# Altium project CPC-UNIFEI.PrjPcb (part 3 of 4)

## Sheet DIGITAL_INPUTS.SchDoc
size A3; SheetNumber: 7; SheetTotal: 14
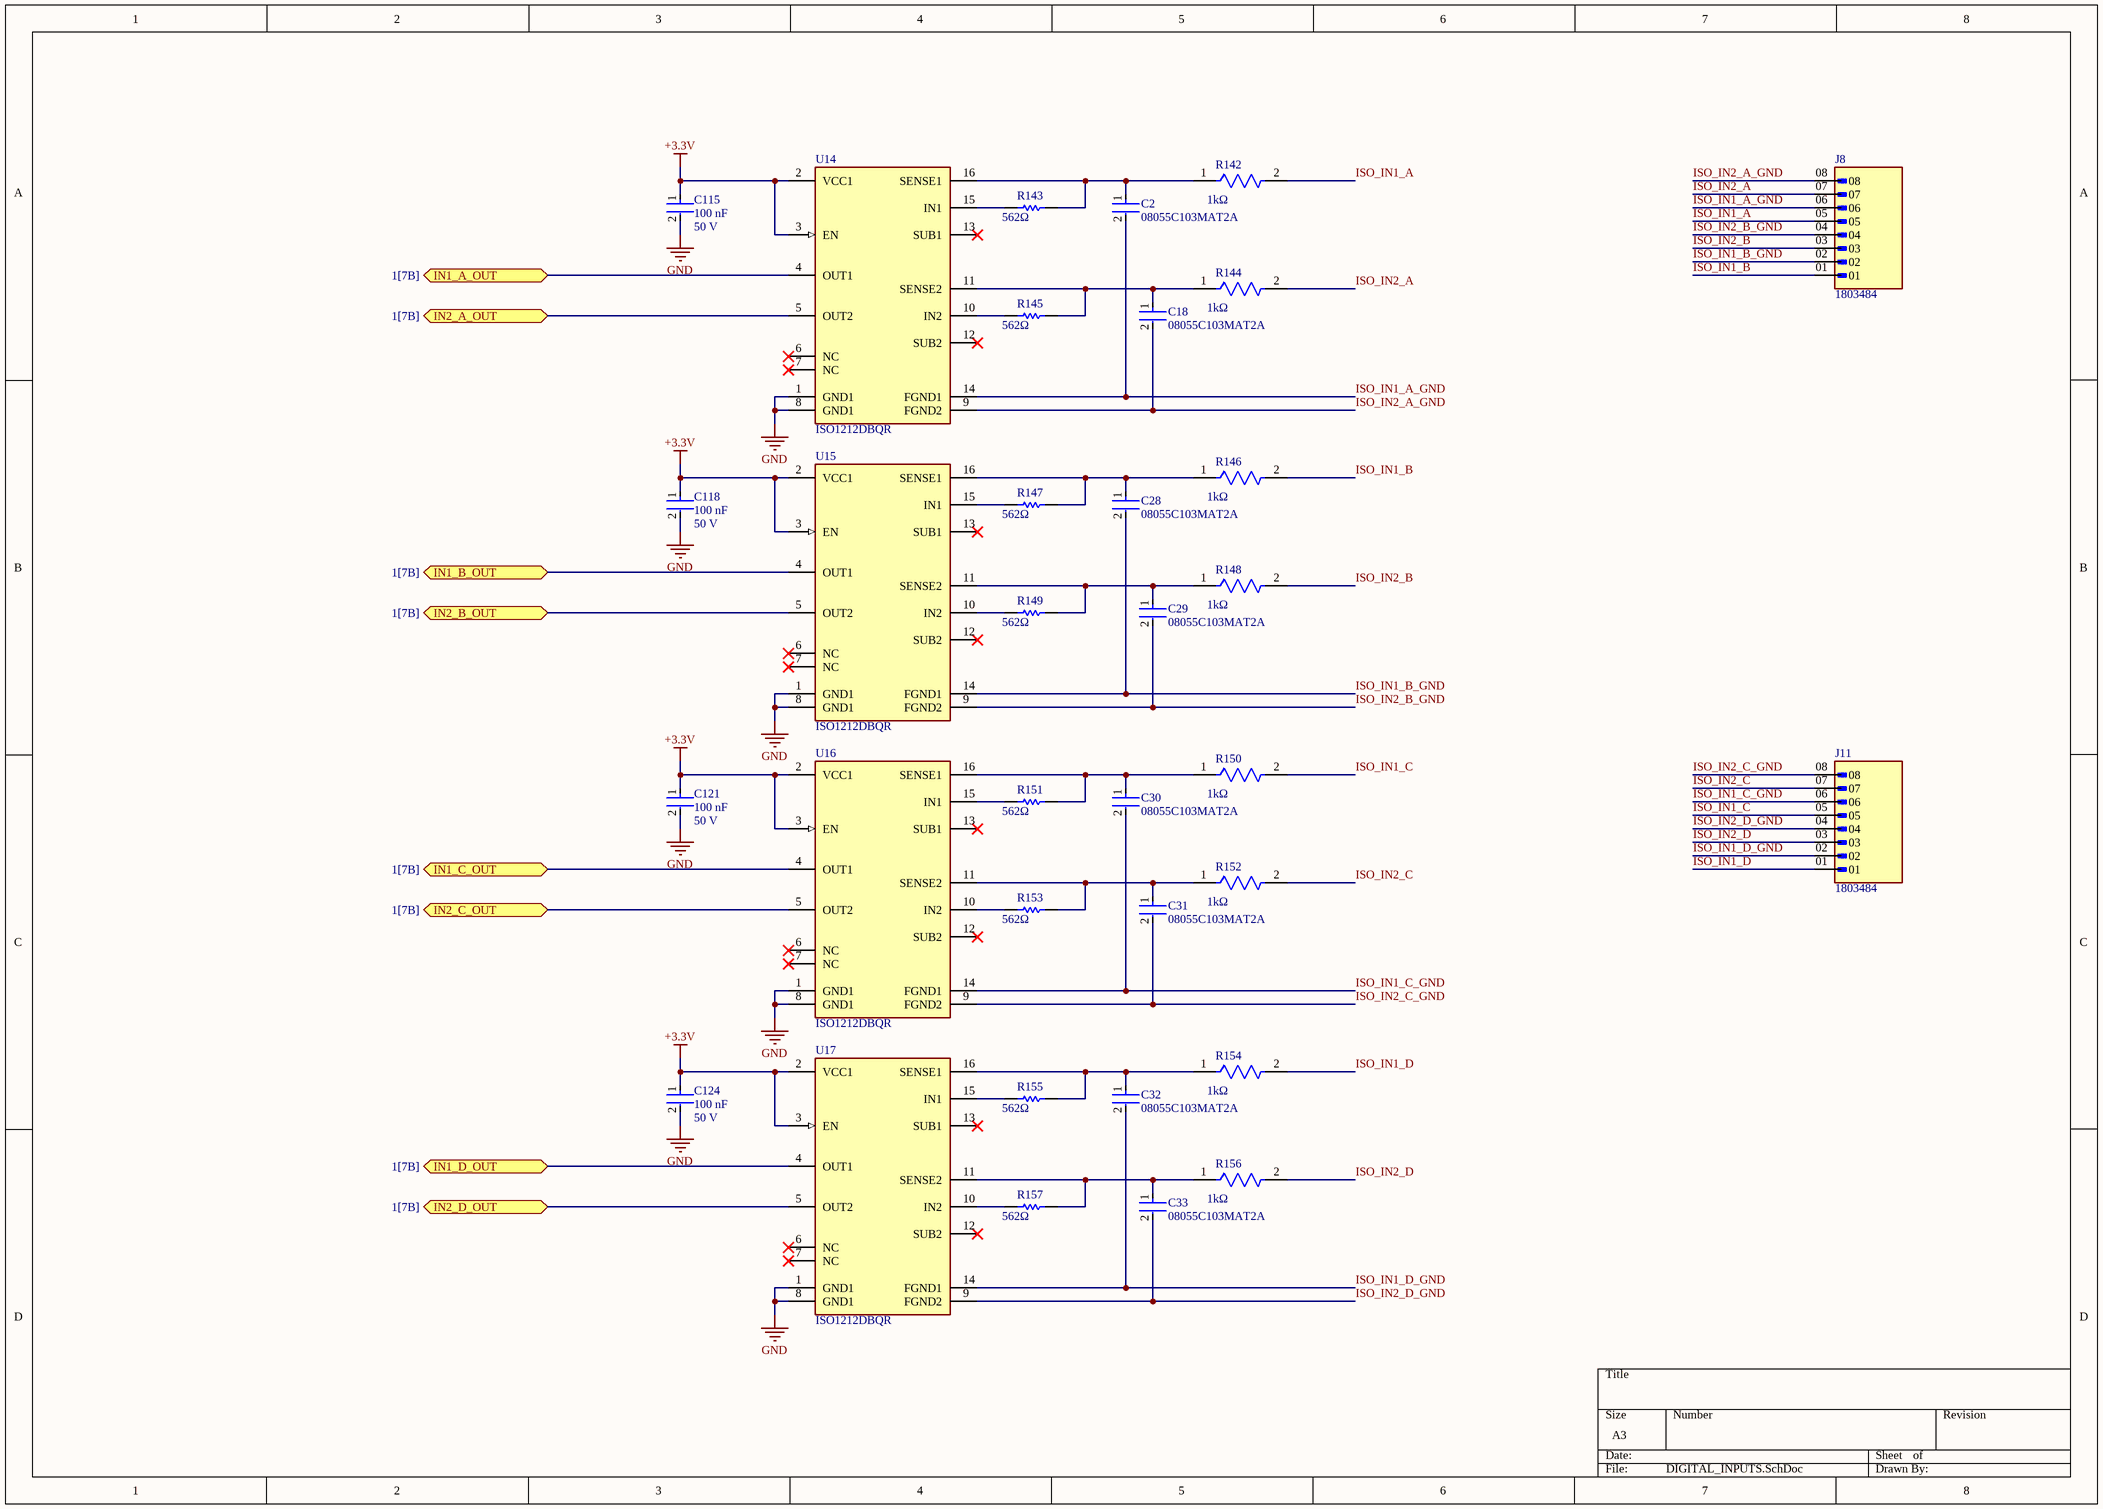
[diagram p6: DIGITAL_INPUTS.SchDoc]

### Parts
C2  08055C103MAT2A  [FP-0805-L_2_01_0_2-W_1_25-MFG]
C18  08055C103MAT2A  [FP-0805-L_2_01_0_2-W_1_25-MFG]
C28  08055C103MAT2A  [FP-0805-L_2_01_0_2-W_1_25-MFG]
C29  08055C103MAT2A  [FP-0805-L_2_01_0_2-W_1_25-MFG]
C30  08055C103MAT2A  [FP-0805-L_2_01_0_2-W_1_25-MFG]
C31  08055C103MAT2A  [FP-0805-L_2_01_0_2-W_1_25-MFG]
C32  08055C103MAT2A  [FP-0805-L_2_01_0_2-W_1_25-MFG]
C33  08055C103MAT2A  [FP-0805-L_2_01_0_2-W_1_25-MFG]
C115  value 100 nF  Voltage Rating: 50 V  [FP-C0603C-CF-IPC_B]  (hidden comment: C0603C104M5RACTU)
C118  value 100 nF  Voltage Rating: 50 V  [FP-C0603C-CF-IPC_B]  (hidden comment: C0603C104M5RACTU)
C121  value 100 nF  Voltage Rating: 50 V  [FP-C0603C-CF-IPC_B]  (hidden comment: C0603C104M5RACTU)
C124  value 100 nF  Voltage Rating: 50 V  [FP-C0603C-CF-IPC_B]  (hidden comment: C0603C104M5RACTU)
J8  1803484  [PHOENIX_1803484]
J11  1803484  [PHOENIX_1803484]
R142  Resistance: 1kΩ  [FP-AC0603-IPC_B]  (hidden comment: AC0603FR-071KL)
R143  Resistance: 562Ω  [RESC1608X55X25ML10T15]  (hidden comment: RC0603FR-07562RL)
R144  Resistance: 1kΩ  [FP-AC0603-IPC_B]  (hidden comment: AC0603FR-071KL)
R145  Resistance: 562Ω  [RESC1608X55X25ML10T15]  (hidden comment: RC0603FR-07562RL)
R146  Resistance: 1kΩ  [FP-AC0603-IPC_B]  (hidden comment: AC0603FR-071KL)
R147  Resistance: 562Ω  [RESC1608X55X25ML10T15]  (hidden comment: RC0603FR-07562RL)
R148  Resistance: 1kΩ  [FP-AC0603-IPC_B]  (hidden comment: AC0603FR-071KL)
R149  Resistance: 562Ω  [RESC1608X55X25ML10T15]  (hidden comment: RC0603FR-07562RL)
R150  Resistance: 1kΩ  [FP-AC0603-IPC_B]  (hidden comment: AC0603FR-071KL)
R151  Resistance: 562Ω  [RESC1608X55X25ML10T15]  (hidden comment: RC0603FR-07562RL)
R152  Resistance: 1kΩ  [FP-AC0603-IPC_B]  (hidden comment: AC0603FR-071KL)
R153  Resistance: 562Ω  [RESC1608X55X25ML10T15]  (hidden comment: RC0603FR-07562RL)
R154  Resistance: 1kΩ  [FP-AC0603-IPC_B]  (hidden comment: AC0603FR-071KL)
R155  Resistance: 562Ω  [RESC1608X55X25ML10T15]  (hidden comment: RC0603FR-07562RL)
R156  Resistance: 1kΩ  [FP-AC0603-IPC_B]  (hidden comment: AC0603FR-071KL)
R157  Resistance: 562Ω  [RESC1608X55X25ML10T15]  (hidden comment: RC0603FR-07562RL)
U14  ISO1212DBQR  [FP-DBQ0016A-MFG]
U15  ISO1212DBQR  [FP-DBQ0016A-MFG]
U16  ISO1212DBQR  [FP-DBQ0016A-MFG]
U17  ISO1212DBQR  [FP-DBQ0016A-MFG]

### Ports
IN1_A_OUT (bidir, see 1[7B]), IN1_B_OUT (bidir, see 1[7B]), IN1_C_OUT (bidir, see 1[7B]), IN1_D_OUT (bidir, see 1[7B]), IN2_A_OUT (bidir, see 1[7B]), IN2_B_OUT (bidir, see 1[7B]), IN2_C_OUT (bidir, see 1[7B]), IN2_D_OUT (bidir, see 1[7B])

### Nets
+3.3V: C115.1 C118.1 C121.1 C124.1 U14.2(VCC1) U14.3(EN) U15.2(VCC1) U15.3(EN) U16.2(VCC1) U16.3(EN) U17.2(VCC1) U17.3(EN)
GND: C115.2 C118.2 C121.2 C124.2 U14.1(GND1) U14.8(GND1) U15.1(GND1) U15.8(GND1) U16.1(GND1) U16.8(GND1) U17.1(GND1) U17.8(GND1)
ISO_IN1_A: J8.05 R142.2
ISO_IN1_A_GND: C2.2 J8.06 U14.14(FGND1)
ISO_IN1_B: J8.01 R146.2
ISO_IN1_B_GND: C28.2 J8.02 U15.14(FGND1)
ISO_IN1_C: J11.05 R150.2
ISO_IN1_C_GND: C30.2 J11.06 U16.14(FGND1)
ISO_IN1_D: J11.01 R154.2
ISO_IN1_D_GND: C32.2 J11.02 U17.14(FGND1)
ISO_IN2_A: J8.07 R144.2
ISO_IN2_A_GND: C18.2 J8.08 U14.9(FGND2)
ISO_IN2_B: J8.03 R148.2
ISO_IN2_B_GND: C29.2 J8.04 U15.9(FGND2)
ISO_IN2_C: J11.07 R152.2
ISO_IN2_C_GND: C31.2 J11.08 U16.9(FGND2)
ISO_IN2_D: J11.03 R156.2
ISO_IN2_D_GND: C33.2 J11.04 U17.9(FGND2)
PE7: U16.5(OUT2) ; port IN2_C_OUT
PE8: U17.4(OUT1) ; port IN1_D_OUT
PE9: U17.5(OUT2) ; port IN2_D_OUT
PF13: U14.4(OUT1) ; port IN1_A_OUT
PF14: U14.5(OUT2) ; port IN2_A_OUT
PF15: U15.4(OUT1) ; port IN1_B_OUT
PG0: U15.5(OUT2) ; port IN2_B_OUT
PG1: U16.4(OUT1) ; port IN1_C_OUT
NetC2_1: C2.1 R142.1 R143.2 U14.16(SENSE1)
NetC18_1: C18.1 R144.1 R145.2 U14.11(SENSE2)
NetC28_1: C28.1 R146.1 R147.2 U15.16(SENSE1)
NetC29_1: C29.1 R148.1 R149.2 U15.11(SENSE2)
NetC30_1: C30.1 R150.1 R151.2 U16.16(SENSE1)
NetC31_1: C31.1 R152.1 R153.2 U16.11(SENSE2)
NetC32_1: C32.1 R154.1 R155.2 U17.16(SENSE1)
NetC33_1: C33.1 R156.1 R157.2 U17.11(SENSE2)
NetR143_1: R143.1 U14.15(IN1)
NetR145_1: R145.1 U14.10(IN2)
NetR147_1: R147.1 U15.15(IN1)
NetR149_1: R149.1 U15.10(IN2)
NetR151_1: R151.1 U16.15(IN1)
NetR153_1: R153.1 U16.10(IN2)
NetR155_1: R155.1 U17.15(IN1)
NetR157_1: R157.1 U17.10(IN2)

Not connected (* = marked no-connect by the designer): U14 6(NC)* 7(NC)* 12(SUB2)* 13(SUB1)*; U15 6(NC)* 7(NC)* 12(SUB2)* 13(SUB1)*; U16 6(NC)* 7(NC)* 12(SUB2)* 13(SUB1)*; U17 6(NC)* 7(NC)* 12(SUB2)* 13(SUB1)*

### Library data of the parts
C2 C18 C28-C33 = CMP-2007-04366-2: General Purpose Ceramic Capacitor, 0805, 10nF, 20%, X7R, 0.15, 50V; Insulation Resistance: 100GR; Dissipation Factor: 2.5%; Mount: Surface Mount; Packaging: Tape and Reel; Max Operating Temperature: 125°C; Series: -; Voltage Rating: 50V; Contact Plating: Tin; Case Code (Metric): 2012; Depth: 1.25mm; Case/Package: 0805; Min Operating Temperature: -55°C; Termination: SMD/SMT; RoHS Compliant: Yes; Height: 0.94mm; Construction: Flat; Voltage: 50V; REACH SVHC: No SVHC; Dielectric: X7R; Voltage Rating (DC): 50V; Case Code (Imperial): 0805; Capacitance: 10nF; Lead Free: Lead Free; Thickness: 0.037inch; Package Quantity: 1; Radiation Hardening: No; Number of Pins: 2; Width: 0.049inch; Dielectric Material: Ceramic; Tolerance: 20%; Length: 2.01mm
C115 C118 C121 C124 = CMP-2006-03068-2: CAP CER 0.1UF 50V 20% X7R 0603; Manufacturer: KEMET; Material: Ceramic; Tolerance: 0.2; Temperature Coefficient: 30ppm/°C; Automotive Grade: Grade 1; Capacitance: 0.10 μF; Temperature Range High: +125°C; Device Class L3: Ceramic Capacitors; Manufacturer Part Number: C0603C104M5RACTU; Height: 0.87mm; Category: Cap; RoHS: TRUE; Digikey Description: CAP CER 0.1UF 50V 20% X7R 0603; ComponentLink2URL: https://api.kemet.com/component-edge/download/datasheet/C0603C100J5GACAUTO.pdf; Lead Free: Yes; Temperature Range Low: -55°C; Device Class L1: Passive Components; ComponentLink2Description: Datasheet; Temperature Characteristic: X7R; Automotive: Yes; Temperature: -55°C to +125°C; Octopart: https://octopart.com/c0603c104m5ractu-kemet-11855687; Device Class L2: Capacitors; Package: C0603C-CF; Mouser Description: Multilayer Ceramic Capacitors MLCC - SMD/SMT 50volts 0.1uF X7R 20%
J8 J11 = 1803484: MF: {'manufacturer': u'Phoenix Contact'}; Package: None; Price: None; Value: *; MP: 1803484; Availability: Unavailable
R142 R144 R146 R148 R150 R152 R154 R156 = CMP-2000-04828-3: RES 1kΩ 1.00% 0.1W 0603; Voltage Rating: 50V; Power Rating: 100mW; Tolerance: 1%; Temperature Coefficient: 100ppm/°C; Depth: 0.8mm; Case/Package: 0603; Size Code: 0603; Case Code (Metric): 1608; Height: 0.022inch; Series: AC; Width: 0.031inch; Construction: Rectangular; Length: 0.063inch; Case Code (Imperial): 0603; Package Quantity: 1; RoHS Compliant: Yes; Features: Moisture Resistant; Resistor Type: Thick Film; Max Power Dissipation: 100mW; Packaging: Tape and Reel; Termination: SMD/SMT; Ratings: AEC-Q200; Max Operating Temperature: 155°C; Min Operating Temperature: -55°C; Military Standard: Not; Lead Free: Lead Free; Number of Terminations: 2
R143 R145 R147 R149 R151 R153 R155 R157 = CMP-2000-04085-1: Manufacturer: Yageo; Part Number: RC0603FR-07562RL
U14-U17 = CMP-04872-000004-1: ISOLATED 24-V TO 60-V DIGITAL IN; Manufacturer: Texas Instruments; Standoff Height: 0.11mm; Max Supply Voltage: 5.5V; Min Supply Voltage: 2.25V; Nominal Supply Current: 194-389mA; Max Junction Temp: +150°C; ComponentLink2URL: http://www.ti.com/lit/ds/symlink/iso1212.pdf; Device Class L1: Integrated Circuits (ICs); Octopart: https://octopart.com/iso1212dbqr-texas+instruments-84619664; Ipc Land Pattern Name: SOP64P600X175-16; Ambient Temperature Range High: +125°C; Automotive: No; Temperature Range High: +125°C; Manufacturer Part Number: ISO1212DBQR; Package: DBQ0016A; Lead Free: Yes; RoHS: TRUE; Device Class L3: unset; Digikey Description: ISOLATED 24-V TO 60-V DIGITAL IN; ComponentLink2Description: Datasheet; Height: 1.75mm; Device Class L2: Interface ICs; Temperature Range Low: -55°C; Ambient Temperature Range Low: -40°C; Category: IC; Temperature: -55°C to +125°C

## Sheet DIGITAL_OUTPUTS_BLOCK_A.SchDoc
size A3; SheetNumber: 8; SheetTotal: 14
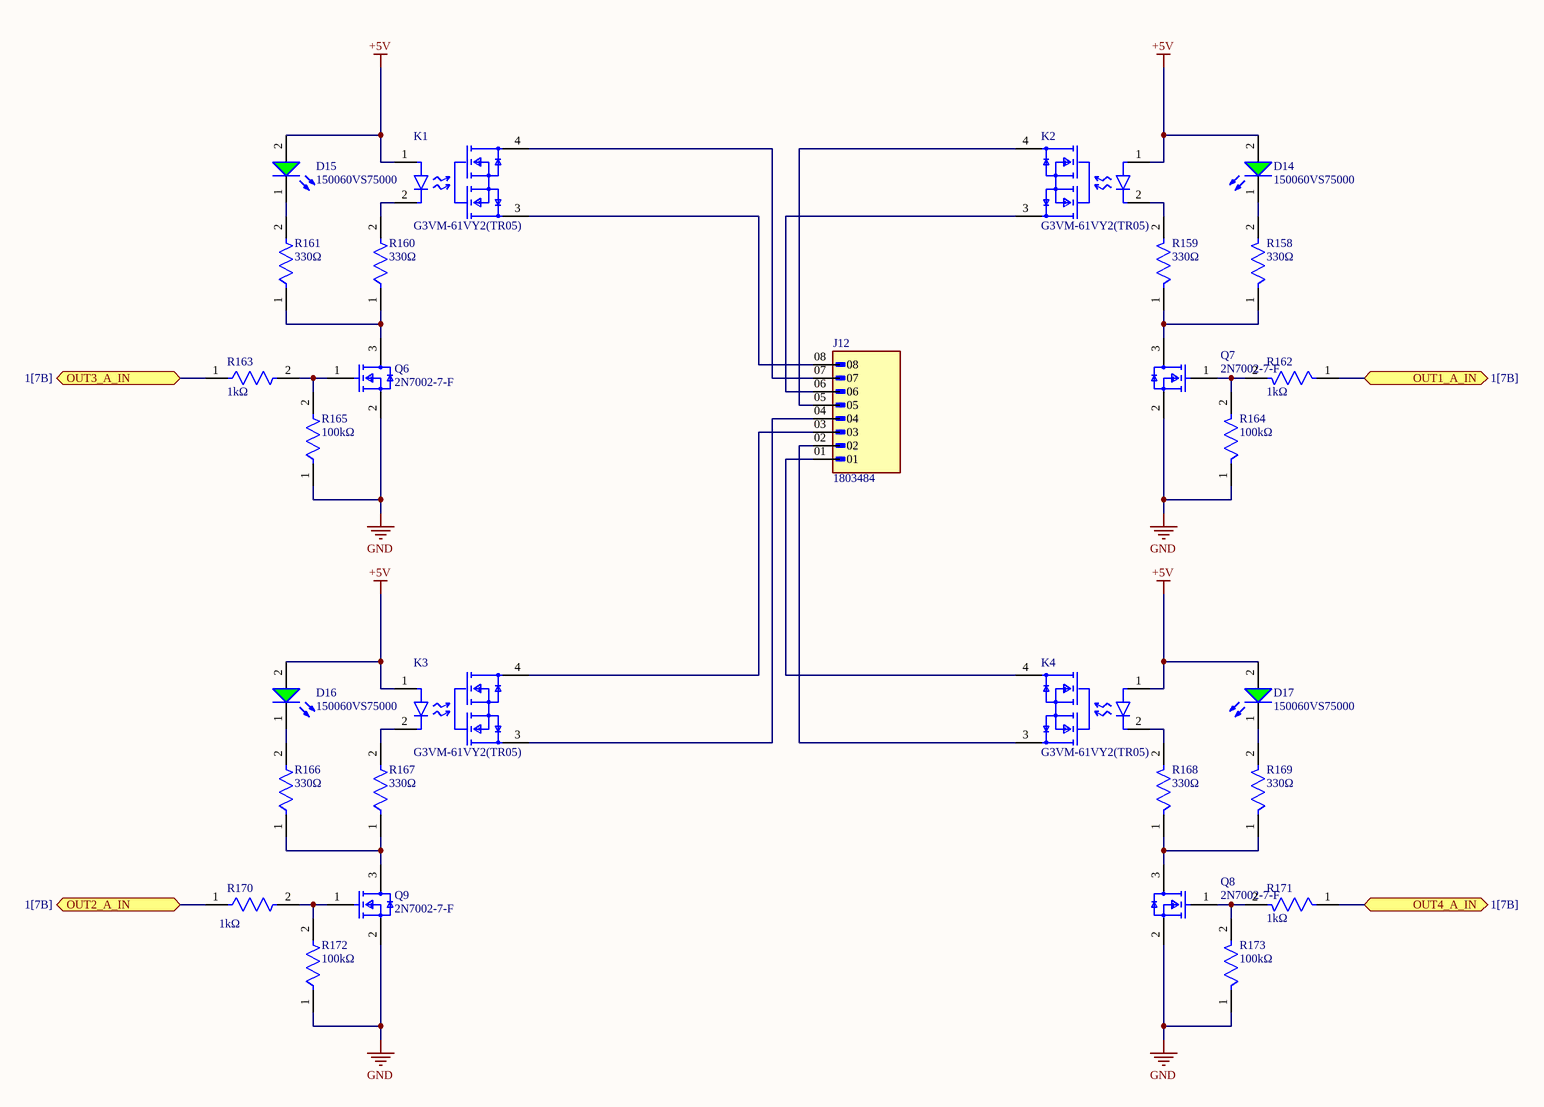
[diagram p7: DIGITAL_OUTPUTS_BLOCK_A.SchDoc]

### Parts
D14  150060VS75000  [WL-SMCW_0603_150060xx75000]
D15  150060VS75000  [WL-SMCW_0603_150060xx75000]
D16  150060VS75000  [WL-SMCW_0603_150060xx75000]
D17  150060VS75000  [WL-SMCW_0603_150060xx75000]
J12  1803484  [PHOENIX_1803484]
K1  G3VM-61VY2(TR05)  [FP-G3VM-61VY2_TR05-MFG]
K2  G3VM-61VY2(TR05)  [FP-G3VM-61VY2_TR05-MFG]
K3  G3VM-61VY2(TR05)  [FP-G3VM-61VY2_TR05-MFG]
K4  G3VM-61VY2(TR05)  [FP-G3VM-61VY2_TR05-MFG]
Q6  2N7002-7-F  [FP-SOT23-IPC_A]
Q7  2N7002-7-F  [FP-SOT23-IPC_A]
Q8  2N7002-7-F  [FP-SOT23-IPC_A]
Q9  2N7002-7-F  [FP-SOT23-IPC_A]
R158  Resistance: 330Ω  [FP-CRCW0603-e3-MFG]  (hidden comment: CRCW0603330RFKEA)
R159  Resistance: 330Ω  [FP-CRCW0603-e3-MFG]  (hidden comment: CRCW0603330RFKEA)
R160  Resistance: 330Ω  [FP-CRCW0603-e3-MFG]  (hidden comment: CRCW0603330RFKEA)
R161  Resistance: 330Ω  [FP-CRCW0603-e3-MFG]  (hidden comment: CRCW0603330RFKEA)
R162  Resistance: 1kΩ  [FP-AC0603-IPC_B]  (hidden comment: AC0603FR-071KL)
R163  Resistance: 1kΩ  [FP-AC0603-IPC_B]  (hidden comment: AC0603FR-071KL)
R164  Resistance: 100kΩ  [FP-CRCW0603-e3-IPC_B]  (hidden comment: CRCW0603100KFKEC)
R165  Resistance: 100kΩ  [FP-CRCW0603-e3-IPC_B]  (hidden comment: CRCW0603100KFKEC)
R166  Resistance: 330Ω  [FP-CRCW0603-e3-MFG]  (hidden comment: CRCW0603330RFKEA)
R167  Resistance: 330Ω  [FP-CRCW0603-e3-MFG]  (hidden comment: CRCW0603330RFKEA)
R168  Resistance: 330Ω  [FP-CRCW0603-e3-MFG]  (hidden comment: CRCW0603330RFKEA)
R169  Resistance: 330Ω  [FP-CRCW0603-e3-MFG]  (hidden comment: CRCW0603330RFKEA)
R170  Resistance: 1kΩ  [FP-AC0603-IPC_B]  (hidden comment: AC0603FR-071KL)
R171  Resistance: 1kΩ  [FP-AC0603-IPC_B]  (hidden comment: AC0603FR-071KL)
R172  Resistance: 100kΩ  [FP-CRCW0603-e3-IPC_B]  (hidden comment: CRCW0603100KFKEC)
R173  Resistance: 100kΩ  [FP-CRCW0603-e3-IPC_B]  (hidden comment: CRCW0603100KFKEC)

### Ports
OUT1_A_IN (bidir, see 1[7B]), OUT2_A_IN (bidir, see 1[7B]), OUT3_A_IN (bidir, see 1[7B]), OUT4_A_IN (bidir, see 1[7B])

### Nets
+5V: D14.2(A) D15.2(A) D16.2(A) D17.2(A) K1.1(A) K2.1(A) K3.1(A) K4.1(A)
GND: Q6.2(S) Q7.2(S) Q8.2(S) Q9.2(S) R164.1 R165.1 R172.1 R173.1
PD0: R162.1 ; port OUT1_A_IN
PD1: R171.1 ; port OUT4_A_IN
PD3: R163.1 ; port OUT3_A_IN
PD4: R170.1 ; port OUT2_A_IN
NetD14_1: D14.1(K) R158.2
NetD15_1: D15.1(K) R161.2
NetD16_1: D16.1(K) R166.2
NetD17_1: D17.1(K) R169.2
NetJ12_01: J12.01 K4.4(2_DRAIN)
NetJ12_02: J12.02 K4.3(1_DRAIN)
NetJ12_03: J12.03 K3.4(2_DRAIN)
NetJ12_04: J12.04 K3.3(1_DRAIN)
NetJ12_05: J12.05 K2.4(2_DRAIN)
NetJ12_06: J12.06 K2.3(1_DRAIN)
NetJ12_07: J12.07 K1.4(2_DRAIN)
NetJ12_08: J12.08 K1.3(1_DRAIN)
NetK1_2: K1.2(C) R160.2
NetK2_2: K2.2(C) R159.2
NetK3_2: K3.2(C) R167.2
NetK4_2: K4.2(C) R168.2
NetQ6_1: Q6.1(G) R163.2 R165.2
NetQ6_3: Q6.3(D) R160.1 R161.1
NetQ7_1: Q7.1(G) R162.2 R164.2
NetQ7_3: Q7.3(D) R158.1 R159.1
NetQ8_1: Q8.1(G) R171.2 R173.2
NetQ8_3: Q8.3(D) R168.1 R169.1
NetQ9_1: Q9.1(G) R170.2 R172.2
NetQ9_3: Q9.3(D) R166.1 R167.1

### Library data of the parts
D14-D17 = CMP-1426-00006-6: NexarPartId: 29717778; Reverse Voltage: 5V; Forward Voltage: 2V; Viewing Angle: 140°; Luminous Intensity: 40mcd; Test Current: 20mA; Max Junction Temperature (Tj): 95°C; Wavelength: 570nm; Forward Current: 100mA; Color: Green; Lens Style: Clear, Rectangular; Power Dissipation: 72mW; Peak Wavelength: 572nm; Packaging: Tape and Reel; REACH SVHC: Unknown; Width: 800µm; Max Operating Temperature: 85°C; Number of Pins: 2; RoHS: Compliant; Dominant Wavelength: 570nm; Min Operating Temperature: -40°C; Case Code (Imperial): 0603; Height: 700µm; Length: 1.6mm; Case Code (Metric): 1608; Case/Package: 0603; Max Reverse Voltage (DC): 5V; Mount: Surface Mount
J12 = 1803484: MF: {'manufacturer': u'Phoenix Contact'}; Package: None; Price: None; Value: *; MP: 1803484; Availability: Unavailable
K1-K4 = CMP-08825-000057-1: SSR RELAY SPST-NO 500MA 0-60V; Throw Configuration: SPST; On-State Resistance: 2R; Load Current: 500mA; RoHS Compliant: Yes; Relay Type: Relay; Case/Package: SOP; Mount: Surface Mount; Termination: Gull Wing; Number of Pins: 4; Packaging: Tape and Reel
Q6-Q9 = CMP-2000-04929-2: MOSFET N-CH 60V 115MA SOT23-3; Turn-On Delay Time: 7ns; Turn-Off Delay Time: 11ns; Drain to Source Resistance: 7.5R; Rise Time: 3ns; Drain to Source Breakdown Voltage: 70V; Input Capacitance: 50pF; Number of Elements: 1; Power Dissipation: 540mW; Max Power Dissipation: 300mW; Fall Time: 5.6ns; Gate to Source Voltage (Vgs): 20V; Threshold Voltage: 2.5V; Element Configuration: Single; Termination: SMD/SMT; Weight: 0.000282oz; Radiation Hardening: No; Max Operating Temperature: 150°C; On-State Resistance: 7.5R; Mount: Surface Mount; Current Rating: 115mA; Contact Plating: Tin; Lead Free: Lead Free; Min Operating Temperature: -55°C; Number of Pins: 3; REACH SVHC: No SVHC; Drain to Source Voltage (Vdss): 60V; Width: 1.3mm; Package Quantity: 3000; Length: 2.9mm; Case/Package: SOT-23; Number of Channels: 1; Dual Supply Voltage: 60V; Packaging: Tape and Reel; Height: 1mm; Voltage Rating (DC): 60V; Nominal Vgs: 2.5V; Continuous Drain Current (ID): 115mA; Voltage: 60V; Rds On Max: 7.5R
R158-R161 R166-R169 = CMP-1012-00454-3: RES Thick Film, 330Ω, 1%, 0.1W, 100ppm/°C, 0603; Voltage Rating: 75V; Max Power Dissipation: 100mW; Depth: 0.85mm; Contact Plating: Tin; Package Quantity: 10; Termination: SMD/SMT; Tolerance: 1%; Height: 0.45mm; Number of Terminations: 2; Radiation Hardening: No; Features: Automotive AEC-Q200; Case/Package: 0603; Mount: Surface Mount; Case Code (Metric): 1608; Lead Free: Lead Free; Temperature Coefficient: 100ppm/°C; Weight: 7.1E-05oz; Military Standard: Not; Packaging: Tape and Reel; Max Operating Temperature: 155°C; Voltage Rating (DC): 75V; Length: 1.55mm; Min Operating Temperature: -55°C; Composition: Thick Film; Case Code (Imperial): 0603; Width: 0.033inch; Power Rating: 100mW
R162 R163 R170 R171 = CMP-2000-04828-3: as R142 on sheet DIGITAL_INPUTS; Depth: 0.8mm; Case/Package: 0603; Size Code: 0603; Case Code (Metric): 1608; Height: 0.022inch; Series: AC; Width: 0.031inch; Construction: Rectangular; Length: 0.063inch; Case Code (Imperial): 0603; Package Quantity: 1; RoHS Compliant: Yes; Features: Moisture Resistant; Resistor Type: Thick Film; Max Power Dissipation: 100mW; Packaging: Tape and Reel; Termination: SMD/SMT; Ratings: AEC-Q200; Max Operating Temperature: 155°C; Min Operating Temperature: -55°C; Military Standard: Not; Lead Free: Lead Free; Number of Terminations: 2
R164 R165 R172 R173 = CMP-2000-03822-2: RES Thick Film, 100kΩ, 1%, 0.1W, 100ppm/°C, 0603; Power Rating: 100mW; Height: 0.02inch; Min Operating Temperature: -55°C; Length: 0.061inch; Temperature Coefficient: 100ppm/°C; Number of Terminations: 2; Packaging: Tape and Reel; Case Code (Imperial): 0603; Case/Package: 0603; Contact Plating: Tin; Radiation Hardening: No; Lead Free: Lead Free; Depth: 0.85mm; Case Code (Metric): 1608; Max Power Dissipation: 100mW; Features: Automotive AEC-Q200; Tolerance: 1%; Max Operating Temperature: 155°C; Composition: Thick Film; Military Standard: Not; Width: 0.033inch

## Sheet DIGITAL_OUTPUTS_BLOCK_B.SchDoc
size A3; SheetNumber: 9; SheetTotal: 14
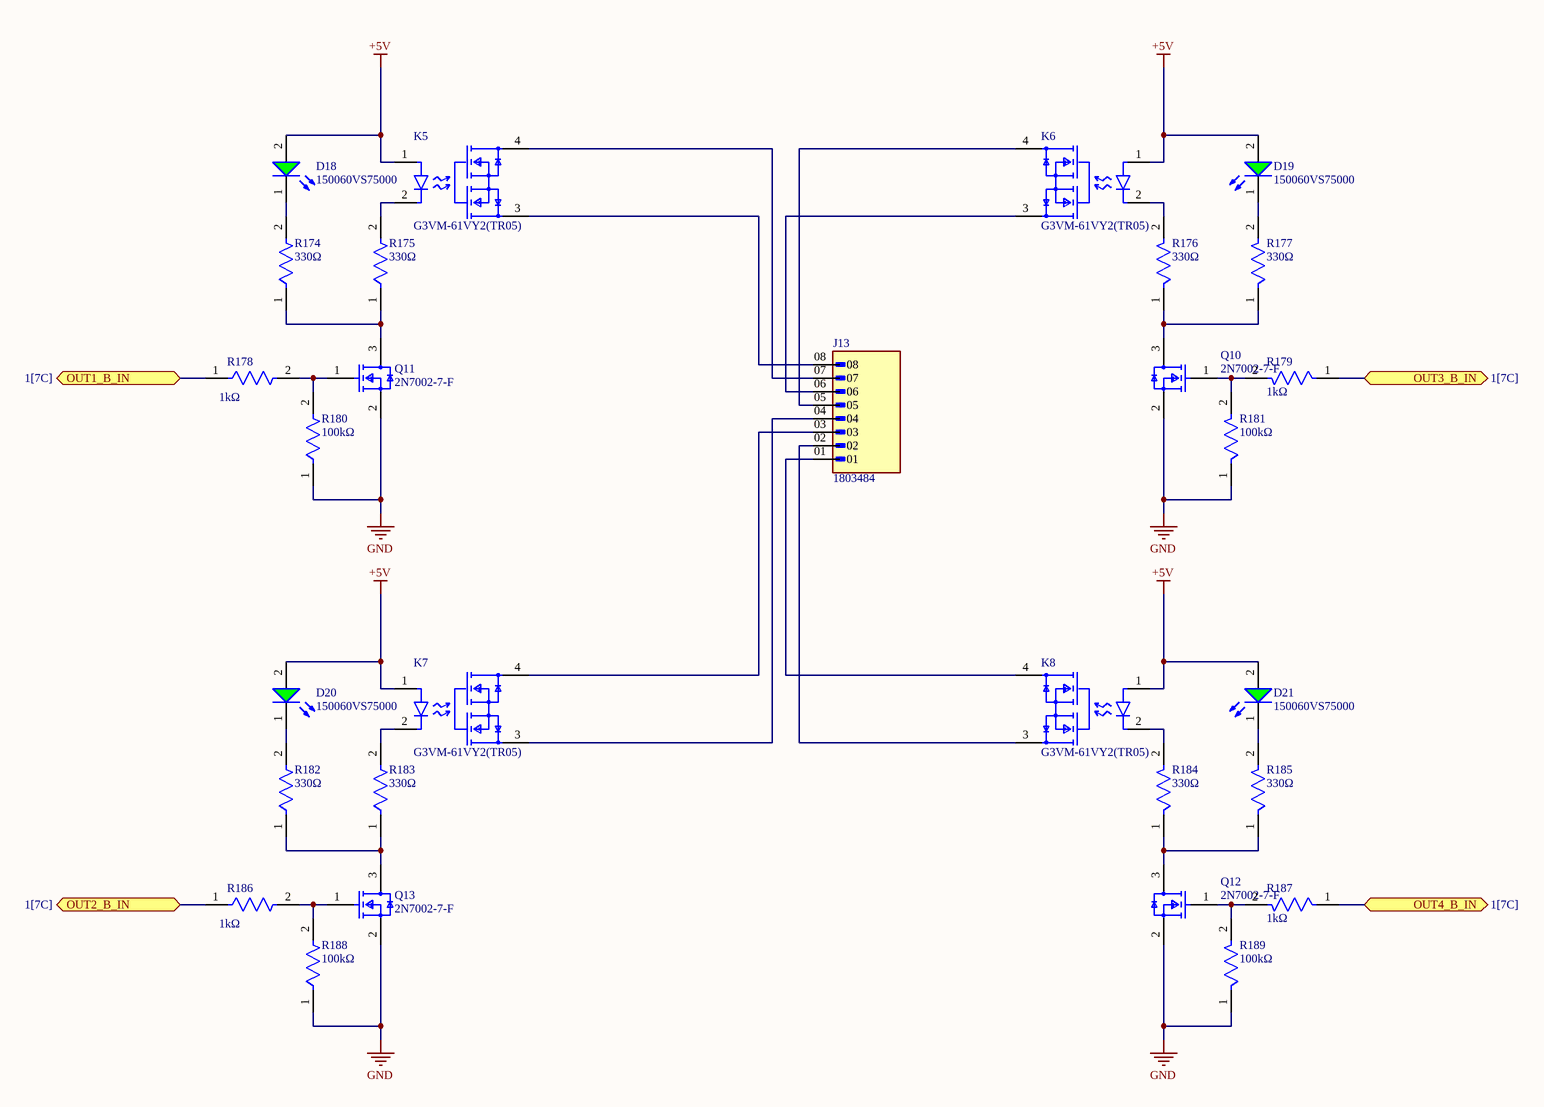
[diagram p8: DIGITAL_OUTPUTS_BLOCK_B.SchDoc]

### Parts
D18  150060VS75000  [WL-SMCW_0603_150060xx75000]
D19  150060VS75000  [WL-SMCW_0603_150060xx75000]
D20  150060VS75000  [WL-SMCW_0603_150060xx75000]
D21  150060VS75000  [WL-SMCW_0603_150060xx75000]
J13  1803484  [PHOENIX_1803484]
K5  G3VM-61VY2(TR05)  [FP-G3VM-61VY2_TR05-MFG]
K6  G3VM-61VY2(TR05)  [FP-G3VM-61VY2_TR05-MFG]
K7  G3VM-61VY2(TR05)  [FP-G3VM-61VY2_TR05-MFG]
K8  G3VM-61VY2(TR05)  [FP-G3VM-61VY2_TR05-MFG]
Q10  2N7002-7-F  [FP-SOT23-IPC_A]
Q11  2N7002-7-F  [FP-SOT23-IPC_A]
Q12  2N7002-7-F  [FP-SOT23-IPC_A]
Q13  2N7002-7-F  [FP-SOT23-IPC_A]
R174  Resistance: 330Ω  [FP-CRCW0603-e3-MFG]  (hidden comment: CRCW0603330RFKEA)
R175  Resistance: 330Ω  [FP-CRCW0603-e3-MFG]  (hidden comment: CRCW0603330RFKEA)
R176  Resistance: 330Ω  [FP-CRCW0603-e3-MFG]  (hidden comment: CRCW0603330RFKEA)
R177  Resistance: 330Ω  [FP-CRCW0603-e3-MFG]  (hidden comment: CRCW0603330RFKEA)
R178  Resistance: 1kΩ  [FP-AC0603-IPC_B]  (hidden comment: AC0603FR-071KL)
R179  Resistance: 1kΩ  [FP-AC0603-IPC_B]  (hidden comment: AC0603FR-071KL)
R180  Resistance: 100kΩ  [FP-CRCW0603-e3-IPC_B]  (hidden comment: CRCW0603100KFKEC)
R181  Resistance: 100kΩ  [FP-CRCW0603-e3-IPC_B]  (hidden comment: CRCW0603100KFKEC)
R182  Resistance: 330Ω  [FP-CRCW0603-e3-MFG]  (hidden comment: CRCW0603330RFKEA)
R183  Resistance: 330Ω  [FP-CRCW0603-e3-MFG]  (hidden comment: CRCW0603330RFKEA)
R184  Resistance: 330Ω  [FP-CRCW0603-e3-MFG]  (hidden comment: CRCW0603330RFKEA)
R185  Resistance: 330Ω  [FP-CRCW0603-e3-MFG]  (hidden comment: CRCW0603330RFKEA)
R186  Resistance: 1kΩ  [FP-AC0603-IPC_B]  (hidden comment: AC0603FR-071KL)
R187  Resistance: 1kΩ  [FP-AC0603-IPC_B]  (hidden comment: AC0603FR-071KL)
R188  Resistance: 100kΩ  [FP-CRCW0603-e3-IPC_B]  (hidden comment: CRCW0603100KFKEC)
R189  Resistance: 100kΩ  [FP-CRCW0603-e3-IPC_B]  (hidden comment: CRCW0603100KFKEC)

### Ports
OUT1_B_IN (bidir, see 1[7C]), OUT2_B_IN (bidir, see 1[7C]), OUT3_B_IN (bidir, see 1[7C]), OUT4_B_IN (bidir, see 1[7C])

### Nets
+5V: D18.2(A) D19.2(A) D20.2(A) D21.2(A) K5.1(A) K6.1(A) K7.1(A) K8.1(A)
GND: Q10.2(S) Q11.2(S) Q12.2(S) Q13.2(S) R180.1 R181.1 R188.1 R189.1
PD5: R178.1 ; port OUT1_B_IN
PD6: R179.1 ; port OUT3_B_IN
PG9: R186.1 ; port OUT2_B_IN
PG10: R187.1 ; port OUT4_B_IN
NetD18_1: D18.1(K) R174.2
NetD19_1: D19.1(K) R177.2
NetD20_1: D20.1(K) R182.2
NetD21_1: D21.1(K) R185.2
NetJ13_01: J13.01 K8.4(2_DRAIN)
NetJ13_02: J13.02 K8.3(1_DRAIN)
NetJ13_03: J13.03 K7.4(2_DRAIN)
NetJ13_04: J13.04 K7.3(1_DRAIN)
NetJ13_05: J13.05 K6.4(2_DRAIN)
NetJ13_06: J13.06 K6.3(1_DRAIN)
NetJ13_07: J13.07 K5.4(2_DRAIN)
NetJ13_08: J13.08 K5.3(1_DRAIN)
NetK5_2: K5.2(C) R175.2
NetK6_2: K6.2(C) R176.2
NetK7_2: K7.2(C) R183.2
NetK8_2: K8.2(C) R184.2
NetQ10_1: Q10.1(G) R179.2 R181.2
NetQ10_3: Q10.3(D) R176.1 R177.1
NetQ11_1: Q11.1(G) R178.2 R180.2
NetQ11_3: Q11.3(D) R174.1 R175.1
NetQ12_1: Q12.1(G) R187.2 R189.2
NetQ12_3: Q12.3(D) R184.1 R185.1
NetQ13_1: Q13.1(G) R186.2 R188.2
NetQ13_3: Q13.3(D) R182.1 R183.1

### Library data of the parts
D18-D21 = CMP-1426-00006-6: as D14-D17 on sheet DIGITAL_OUTPUTS_BLOCK_A; Packaging: Tape and Reel; REACH SVHC: Unknown; Width: 800µm; Max Operating Temperature: 85°C; Number of Pins: 2; RoHS: Compliant; Dominant Wavelength: 570nm; Min Operating Temperature: -40°C; Case Code (Imperial): 0603; Height: 700µm; Length: 1.6mm; Case Code (Metric): 1608; Case/Package: 0603; Max Reverse Voltage (DC): 5V; Mount: Surface Mount
J13 = 1803484: MF: {'manufacturer': u'Phoenix Contact'}; Package: None; Price: None; Value: *; MP: 1803484; Availability: Unavailable
K5-K8 = CMP-08825-000057-1: as K1 on sheet DIGITAL_OUTPUTS_BLOCK_A; Load Current: 500mA; RoHS Compliant: Yes; Relay Type: Relay; Case/Package: SOP; Mount: Surface Mount; Termination: Gull Wing; Number of Pins: 4; Packaging: Tape and Reel
Q10-Q13 = CMP-2000-04929-2: as Q6-Q9 on sheet DIGITAL_OUTPUTS_BLOCK_A; Termination: SMD/SMT; Weight: 0.000282oz; Radiation Hardening: No; Max Operating Temperature: 150°C; On-State Resistance: 7.5R; Mount: Surface Mount; Current Rating: 115mA; Contact Plating: Tin; Lead Free: Lead Free; Min Operating Temperature: -55°C; Number of Pins: 3; REACH SVHC: No SVHC; Drain to Source Voltage (Vdss): 60V; Width: 1.3mm; Package Quantity: 3000; Length: 2.9mm; Case/Package: SOT-23; Number of Channels: 1; Dual Supply Voltage: 60V; Packaging: Tape and Reel; Height: 1mm; Voltage Rating (DC): 60V; Nominal Vgs: 2.5V; Continuous Drain Current (ID): 115mA; Voltage: 60V; Rds On Max: 7.5R
R174-R177 R182-R185 = CMP-1012-00454-3: as R158-R161 on sheet DIGITAL_OUTPUTS_BLOCK_A; Depth: 0.85mm; Contact Plating: Tin; Package Quantity: 10; Termination: SMD/SMT; Tolerance: 1%; Height: 0.45mm; Number of Terminations: 2; Radiation Hardening: No; Features: Automotive AEC-Q200; Case/Package: 0603; Mount: Surface Mount; Case Code (Metric): 1608; Lead Free: Lead Free; Temperature Coefficient: 100ppm/°C; Weight: 7.1E-05oz; Military Standard: Not; Packaging: Tape and Reel; Max Operating Temperature: 155°C; Voltage Rating (DC): 75V; Length: 1.55mm; Min Operating Temperature: -55°C; Composition: Thick Film; Case Code (Imperial): 0603; Width: 0.033inch; Power Rating: 100mW
R178 R179 R186 R187 = CMP-2000-04828-3: as R142 on sheet DIGITAL_INPUTS; Depth: 0.8mm; Case/Package: 0603; Size Code: 0603; Case Code (Metric): 1608; Height: 0.022inch; Series: AC; Width: 0.031inch; Construction: Rectangular; Length: 0.063inch; Case Code (Imperial): 0603; Package Quantity: 1; RoHS Compliant: Yes; Features: Moisture Resistant; Resistor Type: Thick Film; Max Power Dissipation: 100mW; Packaging: Tape and Reel; Termination: SMD/SMT; Ratings: AEC-Q200; Max Operating Temperature: 155°C; Min Operating Temperature: -55°C; Military Standard: Not; Lead Free: Lead Free; Number of Terminations: 2
R180 R181 R188 R189 = CMP-2000-03822-2: as R164 on sheet DIGITAL_OUTPUTS_BLOCK_A; Height: 0.02inch; Min Operating Temperature: -55°C; Length: 0.061inch; Temperature Coefficient: 100ppm/°C; Number of Terminations: 2; Packaging: Tape and Reel; Case Code (Imperial): 0603; Case/Package: 0603; Contact Plating: Tin; Radiation Hardening: No; Lead Free: Lead Free; Depth: 0.85mm; Case Code (Metric): 1608; Max Power Dissipation: 100mW; Features: Automotive AEC-Q200; Tolerance: 1%; Max Operating Temperature: 155°C; Composition: Thick Film; Military Standard: Not; Width: 0.033inch

## Sheet FLASH.SchDoc
size A4; SheetNumber: 11; SheetTotal: 14
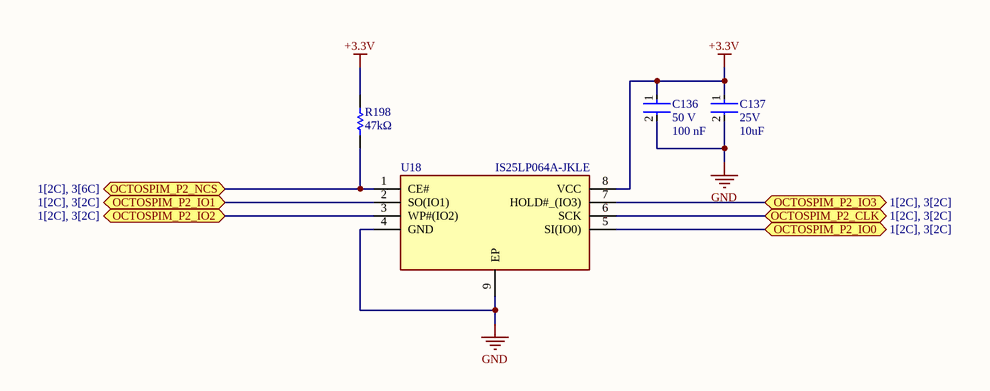
[diagram p9: FLASH.SchDoc]

### Parts
C136  value 100 nF  Voltage Rating: 50 V  [FP-C0603C-CF-IPC_B]  (hidden comment: C0603C104M5RACTU)
C137  Voltage Rating: 25V  Capacitance: 10uF  [FP-C1608-080-IPC_B]  (hidden comment: C1608X5R1E106M080AC)
R198  Resistance: 47kΩ  [RESC1608X55X25ML10T15]  (hidden comment: RC0603FR-1347KL)
U18  IS25LP064A-JKLE  [SON127P600X500X80-9N-D]

### Ports
OCTOSPIM_P2_CLK (bidir, see 1[2C], 3[2C]), OCTOSPIM_P2_IO0 (bidir, see 1[2C], 3[2C]), OCTOSPIM_P2_IO1 (bidir, see 1[2C], 3[2C]), OCTOSPIM_P2_IO2 (bidir, see 1[2C], 3[2C]), OCTOSPIM_P2_IO3 (bidir, see 1[2C], 3[2C]), OCTOSPIM_P2_NCS (bidir, see 1[2C], 3[6C])

### Nets
+3.3V: C136.1 C137.1 R198.2 U18.8(VCC)
GND: C136.2 C137.2 U18.4(GND) U18.9(EP)
PF0: U18.5(SI(IO0)) ; port OCTOSPIM_P2_IO0
PF1: U18.2(SO(IO1)) ; port OCTOSPIM_P2_IO1
PF2: U18.3(WP#(IO2)) ; port OCTOSPIM_P2_IO2
PF3: U18.7(HOLD#_(IO3)) ; port OCTOSPIM_P2_IO3
PF4: U18.6(SCK) ; port OCTOSPIM_P2_CLK
PG12: R198.1 U18.1(CE#) ; port OCTOSPIM_P2_NCS

### Library data of the parts
C136 = CMP-2006-03068-2: as C115 on sheet DIGITAL_INPUTS; Temperature Range High: +125°C; Device Class L3: Ceramic Capacitors; Manufacturer Part Number: C0603C104M5RACTU; Height: 0.87mm; Category: Cap; RoHS: TRUE; Digikey Description: CAP CER 0.1UF 50V 20% X7R 0603; ComponentLink2URL: https://api.kemet.com/component-edge/download/datasheet/C0603C100J5GACAUTO.pdf; Lead Free: Yes; Temperature Range Low: -55°C; Device Class L1: Passive Components; ComponentLink2Description: Datasheet; Temperature Characteristic: X7R; Automotive: Yes; Temperature: -55°C to +125°C; Octopart: https://octopart.com/c0603c104m5ractu-kemet-11855687; Device Class L2: Capacitors; Package: C0603C-CF; Mouser Description: Multilayer Ceramic Capacitors MLCC - SMD/SMT 50volts 0.1uF X7R 20%
C137 = CMP-2000-05442-2: CAP CER 10UF 25V X5R 0603; Dielectric Material: Ceramic; Tolerance: 20%; Dielectric: X5R; Length: 1.6mm; Termination: SMD/SMT; Depth: 0.8mm; RoHS Compliant: Yes; Construction: Flat; Weight: 7.1E-05oz; Thickness: 0.039inch; Packaging: Tape and Reel; Min Operating Temperature: -55°C; Case Code (Imperial): 0603; Case/Package: 0603; Height: 0.8mm; Case Code (Metric): 1608; Resistor Type: Ceramic; Voltage Rating (DC): 25V; Max Operating Temperature: 85°C; REACH SVHC: No SVHC; Lead Free: Lead Free; Series: C; Width: 0.8mm; Mount: Surface Mount; Package Quantity: 1
R198 = CMP-2000-04221-1: Manufacturer: Yageo; Part Number: RC0603FR-1347KL
U18 = IS25LP064A-JKLE: Integrated Circuit; Manufacturer_Name: Integrated Silicon Solution Inc.; Datasheet Link: http://www.issi.com/WW/pdf/25LP032-64A-B.pdf; Height: 0.8mm; Manufacturer_Part_Number: IS25LP064A-JKLE; Mouser Part Number: N/A; Mouser Price/Stock: https://www.mouser.com/Search/Refine.aspx?Keyword=N%2FA; Arrow Part Number: IS25LP064A-JKLE; Arrow Price/Stock: https://www.arrow.com/en/products/is25lp064a-jkle/integrated-silicon-solution-inc?region=nac; Supplier 1: Digikey; Supplier Part Number 1: 706-1595-ND

## Sheet ADS8686S_BLOCK_A.SchDoc
size A3; SheetNumber: 12; SheetTotal: 14
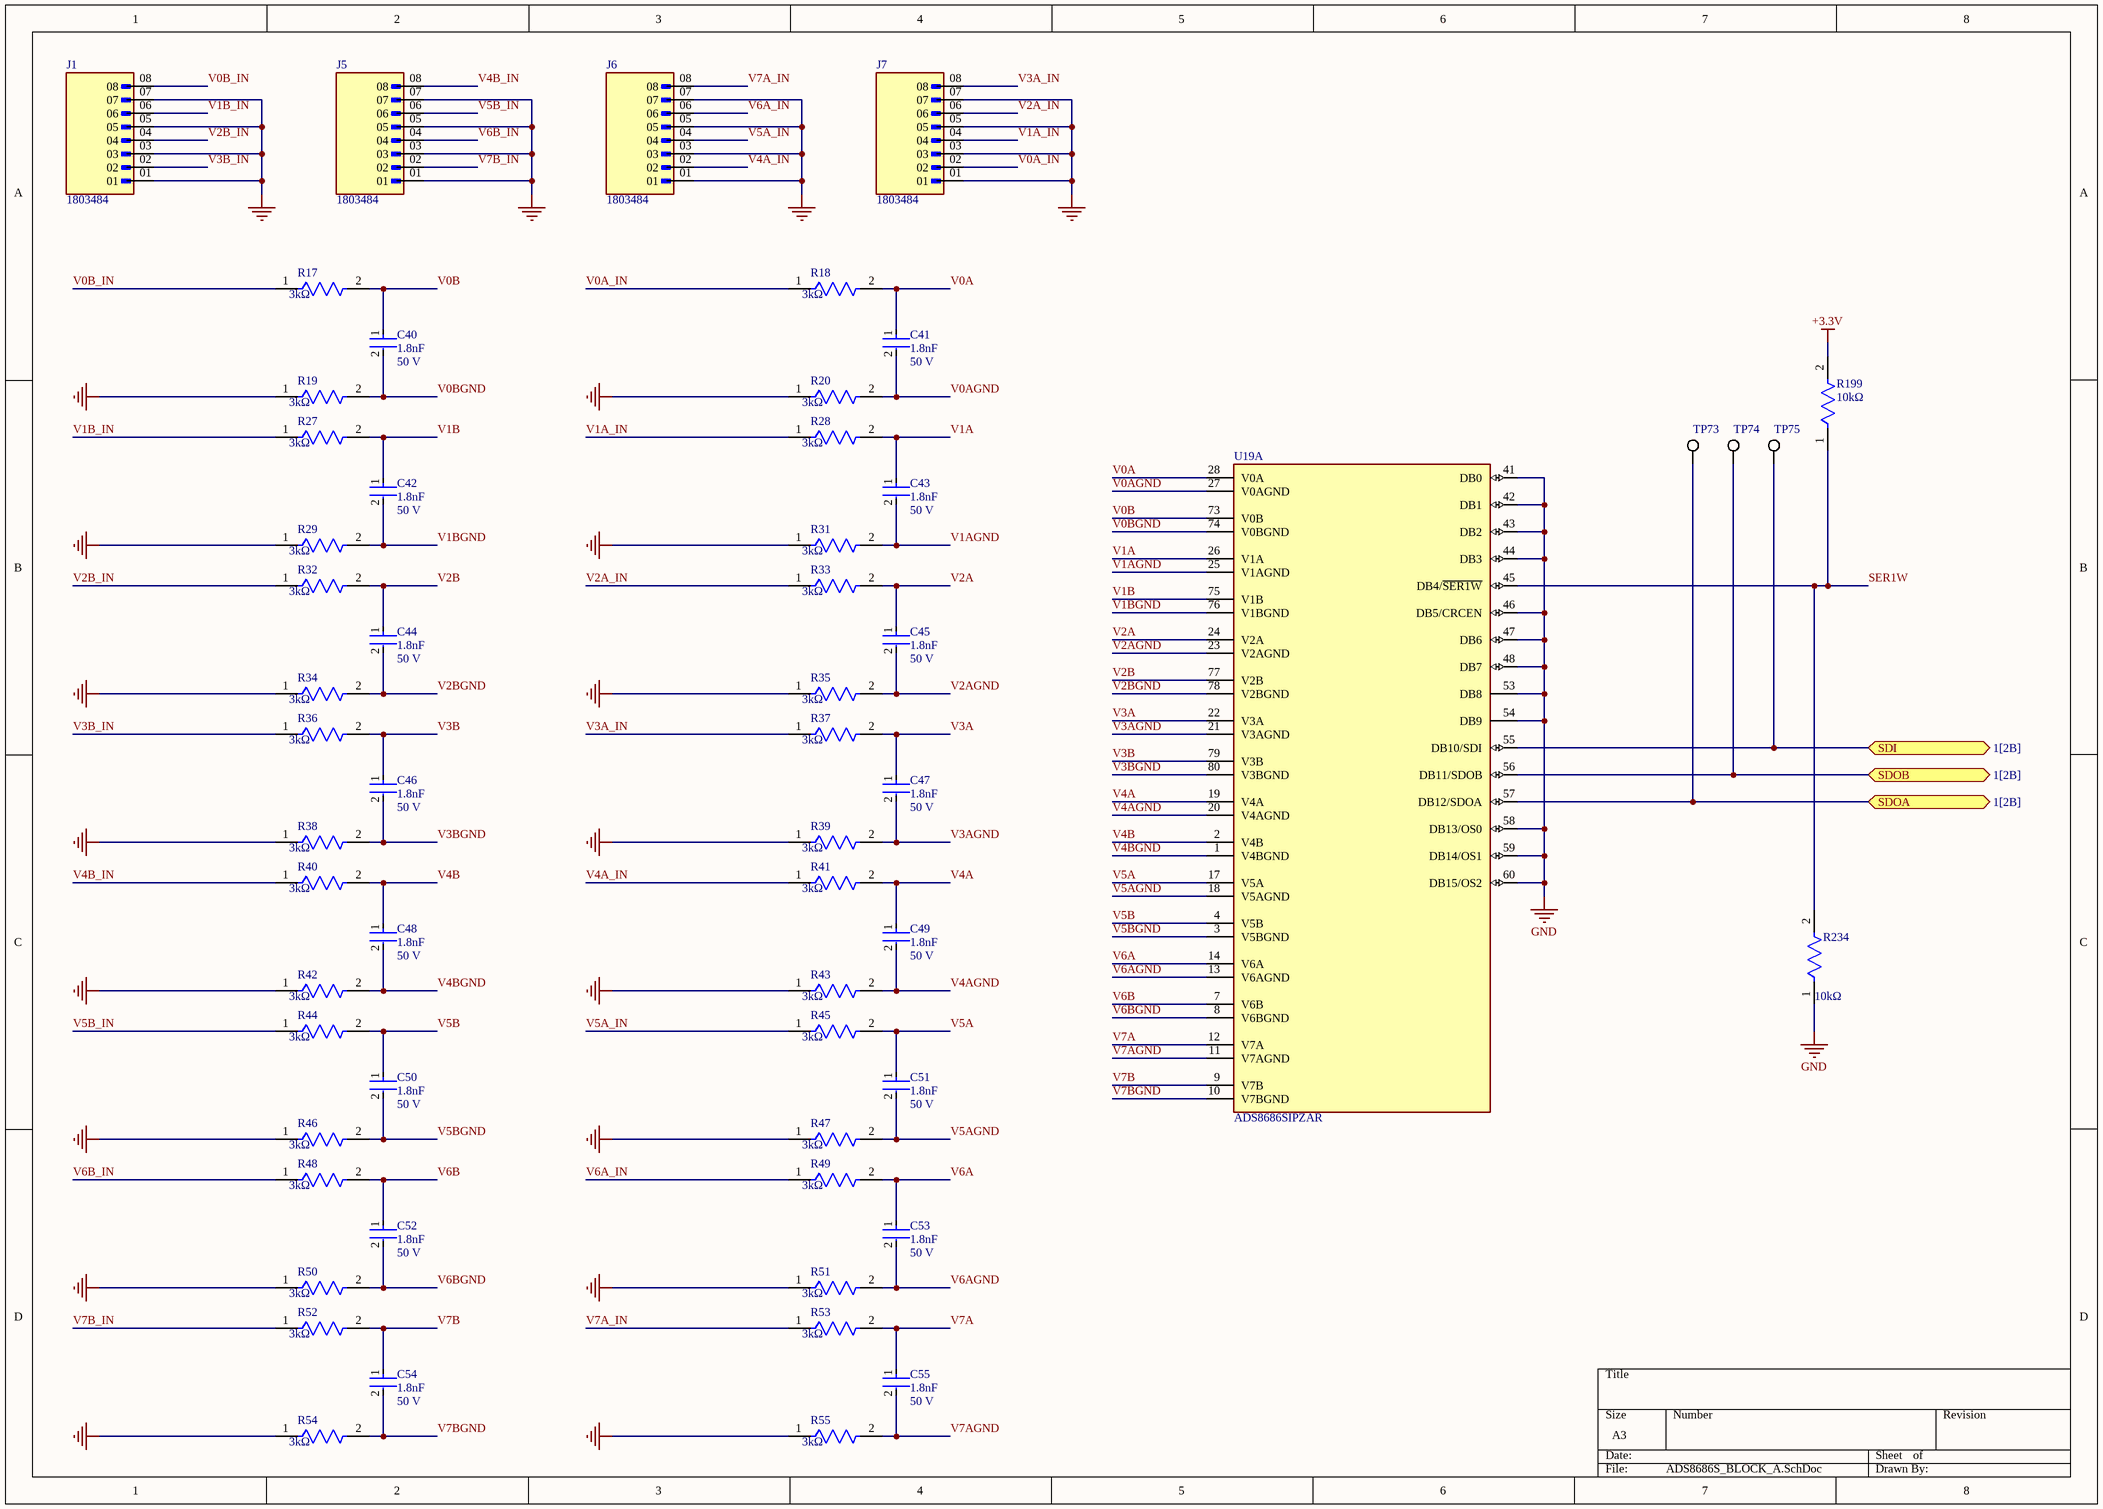
[diagram p10: ADS8686S_BLOCK_A.SchDoc]

### Parts
C40  Capacitance: 1.8nF  Voltage Rating: 50 V  [FP-C0603C-CF-IPC_B]  (hidden comment: C0603C182J5GACTU)
C41  Capacitance: 1.8nF  Voltage Rating: 50 V  [FP-C0603C-CF-IPC_B]  (hidden comment: C0603C182J5GACTU)
C42  Capacitance: 1.8nF  Voltage Rating: 50 V  [FP-C0603C-CF-IPC_B]  (hidden comment: C0603C182J5GACTU)
C43  Capacitance: 1.8nF  Voltage Rating: 50 V  [FP-C0603C-CF-IPC_B]  (hidden comment: C0603C182J5GACTU)
C44  Capacitance: 1.8nF  Voltage Rating: 50 V  [FP-C0603C-CF-IPC_B]  (hidden comment: C0603C182J5GACTU)
C45  Capacitance: 1.8nF  Voltage Rating: 50 V  [FP-C0603C-CF-IPC_B]  (hidden comment: C0603C182J5GACTU)
C46  Capacitance: 1.8nF  Voltage Rating: 50 V  [FP-C0603C-CF-IPC_B]  (hidden comment: C0603C182J5GACTU)
C47  Capacitance: 1.8nF  Voltage Rating: 50 V  [FP-C0603C-CF-IPC_B]  (hidden comment: C0603C182J5GACTU)
C48  Capacitance: 1.8nF  Voltage Rating: 50 V  [FP-C0603C-CF-IPC_B]  (hidden comment: C0603C182J5GACTU)
C49  Capacitance: 1.8nF  Voltage Rating: 50 V  [FP-C0603C-CF-IPC_B]  (hidden comment: C0603C182J5GACTU)
C50  Capacitance: 1.8nF  Voltage Rating: 50 V  [FP-C0603C-CF-IPC_B]  (hidden comment: C0603C182J5GACTU)
C51  Capacitance: 1.8nF  Voltage Rating: 50 V  [FP-C0603C-CF-IPC_B]  (hidden comment: C0603C182J5GACTU)
C52  Capacitance: 1.8nF  Voltage Rating: 50 V  [FP-C0603C-CF-IPC_B]  (hidden comment: C0603C182J5GACTU)
C53  Capacitance: 1.8nF  Voltage Rating: 50 V  [FP-C0603C-CF-IPC_B]  (hidden comment: C0603C182J5GACTU)
C54  Capacitance: 1.8nF  Voltage Rating: 50 V  [FP-C0603C-CF-IPC_B]  (hidden comment: C0603C182J5GACTU)
C55  Capacitance: 1.8nF  Voltage Rating: 50 V  [FP-C0603C-CF-IPC_B]  (hidden comment: C0603C182J5GACTU)
J1  1803484  [PHOENIX_1803484]
J5  1803484  [PHOENIX_1803484]
J6  1803484  [PHOENIX_1803484]
J7  1803484  [PHOENIX_1803484]
R17  Resistance: 3kΩ  [FP-AC0603-IPC_B]  (hidden comment: AC0603FR-073KL)
R18  Resistance: 3kΩ  [FP-AC0603-IPC_B]  (hidden comment: AC0603FR-073KL)
R19  Resistance: 3kΩ  [FP-AC0603-IPC_B]  (hidden comment: AC0603FR-073KL)
R20  Resistance: 3kΩ  [FP-AC0603-IPC_B]  (hidden comment: AC0603FR-073KL)
R27  Resistance: 3kΩ  [FP-AC0603-IPC_B]  (hidden comment: AC0603FR-073KL)
R28  Resistance: 3kΩ  [FP-AC0603-IPC_B]  (hidden comment: AC0603FR-073KL)
R29  Resistance: 3kΩ  [FP-AC0603-IPC_B]  (hidden comment: AC0603FR-073KL)
R31  Resistance: 3kΩ  [FP-AC0603-IPC_B]  (hidden comment: AC0603FR-073KL)
R32  Resistance: 3kΩ  [FP-AC0603-IPC_B]  (hidden comment: AC0603FR-073KL)
R33  Resistance: 3kΩ  [FP-AC0603-IPC_B]  (hidden comment: AC0603FR-073KL)
R34  Resistance: 3kΩ  [FP-AC0603-IPC_B]  (hidden comment: AC0603FR-073KL)
R35  Resistance: 3kΩ  [FP-AC0603-IPC_B]  (hidden comment: AC0603FR-073KL)
R36  Resistance: 3kΩ  [FP-AC0603-IPC_B]  (hidden comment: AC0603FR-073KL)
R37  Resistance: 3kΩ  [FP-AC0603-IPC_B]  (hidden comment: AC0603FR-073KL)
R38  Resistance: 3kΩ  [FP-AC0603-IPC_B]  (hidden comment: AC0603FR-073KL)
R39  Resistance: 3kΩ  [FP-AC0603-IPC_B]  (hidden comment: AC0603FR-073KL)
R40  Resistance: 3kΩ  [FP-AC0603-IPC_B]  (hidden comment: AC0603FR-073KL)
R41  Resistance: 3kΩ  [FP-AC0603-IPC_B]  (hidden comment: AC0603FR-073KL)
R42  Resistance: 3kΩ  [FP-AC0603-IPC_B]  (hidden comment: AC0603FR-073KL)
R43  Resistance: 3kΩ  [FP-AC0603-IPC_B]  (hidden comment: AC0603FR-073KL)
R44  Resistance: 3kΩ  [FP-AC0603-IPC_B]  (hidden comment: AC0603FR-073KL)
R45  Resistance: 3kΩ  [FP-AC0603-IPC_B]  (hidden comment: AC0603FR-073KL)
R46  Resistance: 3kΩ  [FP-AC0603-IPC_B]  (hidden comment: AC0603FR-073KL)
R47  Resistance: 3kΩ  [FP-AC0603-IPC_B]  (hidden comment: AC0603FR-073KL)
R48  Resistance: 3kΩ  [FP-AC0603-IPC_B]  (hidden comment: AC0603FR-073KL)
R49  Resistance: 3kΩ  [FP-AC0603-IPC_B]  (hidden comment: AC0603FR-073KL)
R50  Resistance: 3kΩ  [FP-AC0603-IPC_B]  (hidden comment: AC0603FR-073KL)
R51  Resistance: 3kΩ  [FP-AC0603-IPC_B]  (hidden comment: AC0603FR-073KL)
R52  Resistance: 3kΩ  [FP-AC0603-IPC_B]  (hidden comment: AC0603FR-073KL)
R53  Resistance: 3kΩ  [FP-AC0603-IPC_B]  (hidden comment: AC0603FR-073KL)
R54  Resistance: 3kΩ  [FP-AC0603-IPC_B]  (hidden comment: AC0603FR-073KL)
R55  Resistance: 3kΩ  [FP-AC0603-IPC_B]  (hidden comment: AC0603FR-073KL)
R199  Resistance: 10kΩ  [FP-RC0603-0_55-IPC_B]  (hidden comment: RC0603FR-0710KL)
R234  Resistance: 10kΩ  [FP-RC0603-0_55-IPC_B]  (hidden comment: RC0603FR-0710KL)
TP73  5019  [KSTN-5019_V]  (value not drawn)
TP74  5019  [KSTN-5019_V]  (value not drawn)
TP75  5019  [KSTN-5019_V]  (value not drawn)
U19  ADS8686SIPZAR  [TI-RECOMMENDED]  (part A of 2)

### Ports
SDI (bidir, see 1[2B]), SDOA (bidir, see 1[2B]), SDOB (bidir, see 1[2B])

### Nets
+3.3V: R199.2
GND: J1.01 J1.03 J1.05 J1.07 J5.01 J5.03 J5.05 J5.07 J6.01 J6.03 J6.05 J6.07 J7.01 J7.03 J7.05 J7.07 R19.1 R20.1 R29.1 R31.1 R34.1 R35.1 R38.1 R39.1 R42.1 R43.1 R46.1 R47.1 R50.1 R51.1 R54.1 R55.1 R234.1 U19.41(DB0) U19.42(DB1) U19.43(DB2) U19.44(DB3) U19.46(DB5/CRCEN) U19.47(DB6) U19.48(DB7) U19.53(DB8) U19.54(DB9) U19.58(DB13/OS0) U19.59(DB14/OS1) U19.60(DB15/OS2)
PA6: TP73.1 U19.57(DB12/SDOA) ; port SDOA
PC3: TP74.1 U19.56(DB11/SDOB) ; port SDOB
PD7: TP75.1 U19.55(DB10/SDI) ; port SDI
SER1W: R199.1 R234.2 U19.45(DB4/~{SER1W})
V0A: C41.1 R18.2 U19.28(V0A)
V0A_IN: J7.02 R18.1
V0AGND: C41.2 R20.2 U19.27(V0AGND)
V0B: C40.1 R17.2 U19.73(V0B)
V0B_IN: J1.08 R17.1
V0BGND: C40.2 R19.2 U19.74(V0BGND)
V1A: C43.1 R28.2 U19.26(V1A)
V1A_IN: J7.04 R28.1
V1AGND: C43.2 R31.2 U19.25(V1AGND)
V1B: C42.1 R27.2 U19.75(V1B)
V1B_IN: J1.06 R27.1
V1BGND: C42.2 R29.2 U19.76(V1BGND)
V2A: C45.1 R33.2 U19.24(V2A)
V2A_IN: J7.06 R33.1
V2AGND: C45.2 R35.2 U19.23(V2AGND)
V2B: C44.1 R32.2 U19.77(V2B)
V2B_IN: J1.04 R32.1
V2BGND: C44.2 R34.2 U19.78(V2BGND)
V3A: C47.1 R37.2 U19.22(V3A)
V3A_IN: J7.08 R37.1
V3AGND: C47.2 R39.2 U19.21(V3AGND)
V3B: C46.1 R36.2 U19.79(V3B)
V3B_IN: J1.02 R36.1
V3BGND: C46.2 R38.2 U19.80(V3BGND)
V4A: C49.1 R41.2 U19.19(V4A)
V4A_IN: J6.02 R41.1
V4AGND: C49.2 R43.2 U19.20(V4AGND)
V4B: C48.1 R40.2 U19.2(V4B)
V4B_IN: J5.08 R40.1
V4BGND: C48.2 R42.2 U19.1(V4BGND)
V5A: C51.1 R45.2 U19.17(V5A)
V5A_IN: J6.04 R45.1
V5AGND: C51.2 R47.2 U19.18(V5AGND)
V5B: C50.1 R44.2 U19.4(V5B)
V5B_IN: J5.06 R44.1
V5BGND: C50.2 R46.2 U19.3(V5BGND)
V6A: C53.1 R49.2 U19.14(V6A)
V6A_IN: J6.06 R49.1
V6AGND: C53.2 R51.2 U19.13(V6AGND)
V6B: C52.1 R48.2 U19.7(V6B)
V6B_IN: J5.04 R48.1
V6BGND: C52.2 R50.2 U19.8(V6BGND)
V7A: C55.1 R53.2 U19.12(V7A)
V7A_IN: J6.08 R53.1
V7AGND: C55.2 R55.2 U19.11(V7AGND)
V7B: C54.1 R52.2 U19.9(V7B)
V7B_IN: J5.02 R52.1
V7BGND: C54.2 R54.2 U19.10(V7BGND)

### Library data of the parts
C40-C55 = CMP-2006-03369-2: CAP CER 1800PF 50V NP0 0603; Manufacturer: KEMET; Value: 1,800 pF; Temperature Characteristic: C0G; Tolerance: 0.05; Material: Ceramic; Automotive Grade: Grade 1; Temperature Coefficient: 30ppm/°C; Package: C0603C-CF; Temperature Range High: +125°C; Temperature Range Low: -55°C; Category: Cap; Automotive: Yes; Manufacturer Part Number: C0603C182J5GACTU; RoHS: TRUE; Device Class L2: Capacitors; Device Class L3: Ceramic Capacitors; Octopart: https://octopart.com/c0603c182j5gactu-kemet-13174208; Lead Free: Yes; Temperature: -55°C to +125°C; Height: 0.87mm; Mouser Description: Multilayer Ceramic Capacitors MLCC - SMD/SMT 50volts 1800pF 5% C0G; Digikey Description: CAP CER 1800PF 50V NP0 0603; Device Class L1: Passive Components; ComponentLink2URL: https://api.kemet.com/component-edge/download/datasheet/C0603C100J5GACAUTO.pdf; ComponentLink2Description: Datasheet
J1 J5-J7 = 1803484: MF: {'manufacturer': u'Phoenix Contact'}; Package: None; Price: None; Value: *; MP: 1803484; Availability: Unavailable
R17-R20 R27-R29 R31-R55 = CMP-2000-04842-2: RES 3kΩ 1.00% 0.1W 0603; Max Power Dissipation: 100mW; Temperature Coefficient: 100ppm/°C; Tolerance: 1%; Voltage Rating: 50V; Series: AC; Lead Free: Lead Free; Height: 0.45mm; Case Code (Metric): 1608; Case Code (Imperial): 0603; Case/Package: 0603; Length: 1.6mm; RoHS Compliant: Yes; Width: 0.8mm; Ratings: AEC-Q200; Packaging: Tape and Reel; Termination: SMD/SMT; Max Operating Temperature: 155°C; Resistor Type: Thick Film; Power Rating: 100mW; Min Operating Temperature: -55°C; Number of Terminations: 2; Features: Moisture Resistant
R199 R234 = CMP-2100-03664-2: RES 10K OHM 1% 1/10W 0603; Voltage Rating: 75V; Voltage Rating (DC): 50V; Power Rating: 100mW; Temperature Coefficient: 100ppm/°C; Depth: 0.8mm; Termination: SMD/SMT; Resistor Type: Thick Film; Series: RC; Construction: Rectangular; Features: Moisture Resistant; Packaging: Tape and Reel; Min Operating Temperature: -55°C; Number of Terminations: 2; Lead Pitch: 0.3mm; RoHS Compliant: Yes; Case/Package: 0603; Resistance Tolerance: 1%; Military Standard: Not; Weight: 7.1E-05oz; Number of Pins: 2; Tolerance: 1%; Length: 1.6mm; Case Code (Imperial): 0603; Lead Free: Lead Free; Width: 0.8mm; Max Power Dissipation: 100mW; Height: 0.45mm; Max Operating Temperature: 155°C; Case Code (Metric): 1608; Size Code: 0603
TP73-TP75 = CMP-1672-00008-1: Test Point, 1 Position SMD, RoHS, Tape and Reel; ComponentLink1Description: Manufacturer URL; Package Quantity: 1000; DatasheetVersion: 03/2014; Packaging: Tape and Reel; ComponentLink2URL: http://www.keyelco.com/product-pdf.cfm?p=1357; ComponentLink1URL: http://www.keyelco.com/; Mount: Surface Mount; Contact Plating: Silver; PackageDescription: 1-Pin Surface Mount Device, Body 3.81 x 2.03 mm; Pins: 1; RoHSCompliant: True; Mounting Technology: Surface Mount; ComponentLink2Description: Datasheet; PackageReference: 5019
U19 = ADS8686SIPZAR: 16-channel 16-bit 1-MSPS dual simultaneous-sampling ADC with integrated analog front end (AFE) 80-LQFP -40 to 125; Manufacturer: Texas Instruments; Supplier: Mouser; Supplier Part Number: 595-ADS8686SIPZAR; Manufacturer Part Number: ADS8686SIPZAR; RoHS: Yes; Category: Analog to Digital Converters (ADCs); Stock: 975; Pricing: 1=20.61, 10=19.01, 50=18.16, 100=16.24, 1000=13.88, 10000=13.88 (USD); RoHS Compliant: Yes; Supplier 1: Mouser; Supplier Part Number 1: 595-ADS8686SIPZAR

## Sheet ADS8686S_BLOCK_B.SchDoc
size A4; SheetNumber: 13; SheetTotal: 14
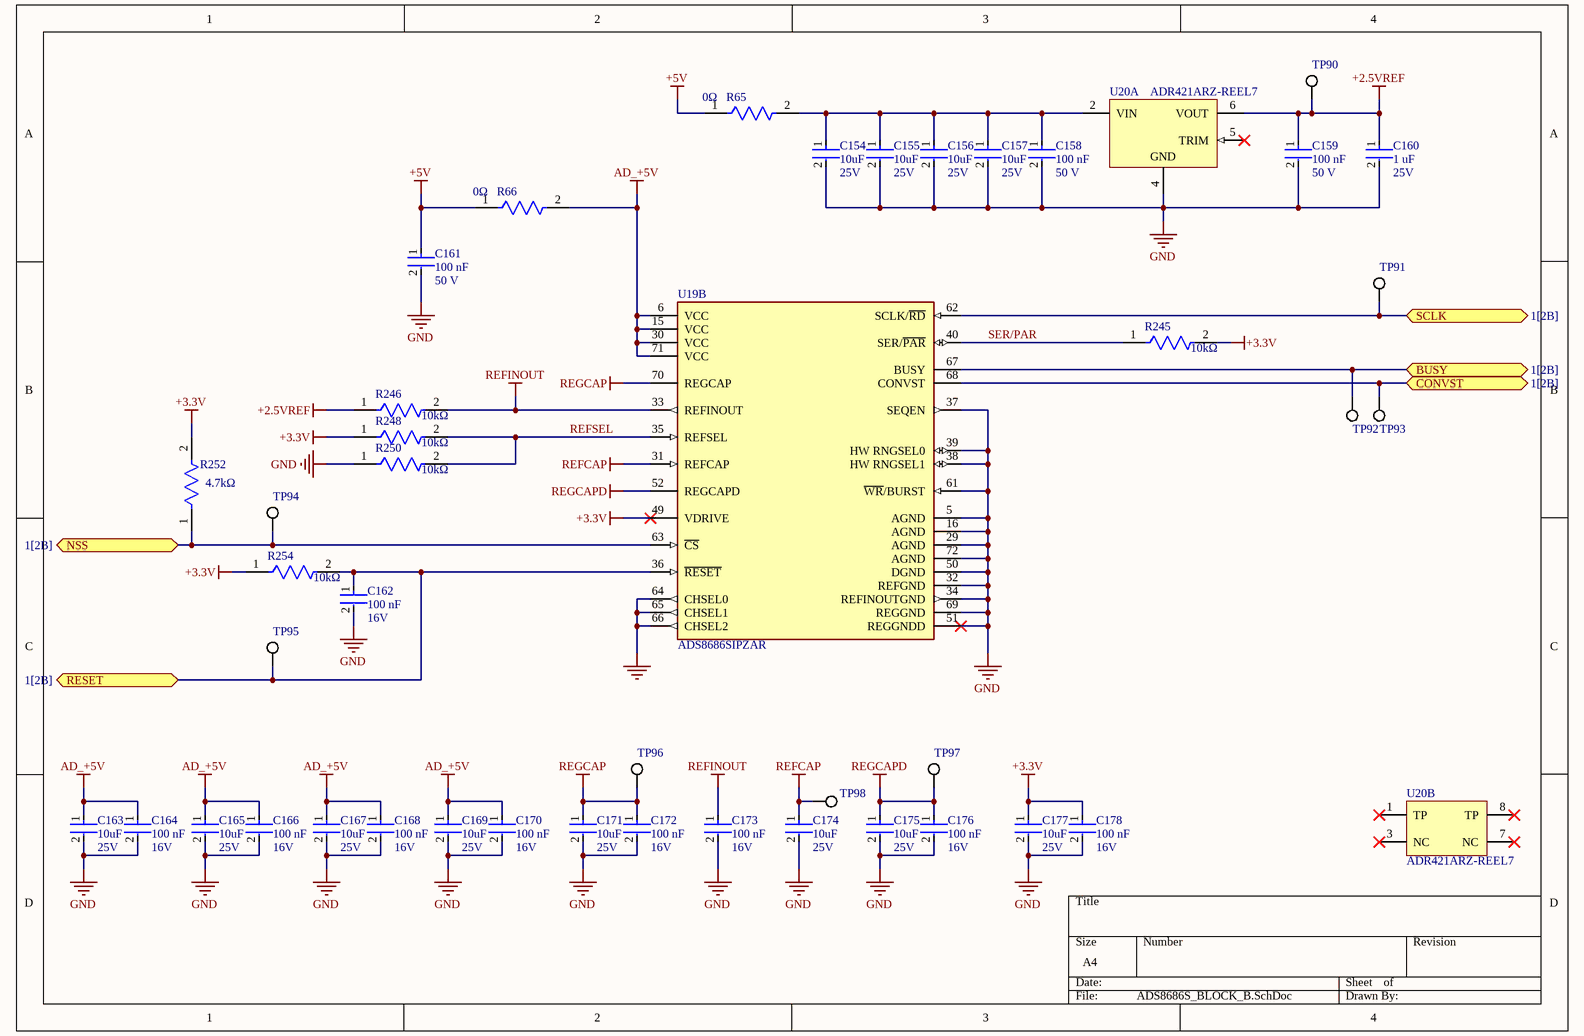
[diagram p11: ADS8686S_BLOCK_B.SchDoc]

### Parts
C154  Voltage Rating: 25V  Capacitance: 10uF  [FP-C1608-080-IPC_B]  (hidden comment: C1608X5R1E106M080AC)
C155  Voltage Rating: 25V  Capacitance: 10uF  [FP-C1608-080-IPC_B]  (hidden comment: C1608X5R1E106M080AC)
C156  Voltage Rating: 25V  Capacitance: 10uF  [FP-C1608-080-IPC_B]  (hidden comment: C1608X5R1E106M080AC)
C157  Voltage Rating: 25V  Capacitance: 10uF  [FP-C1608-080-IPC_B]  (hidden comment: C1608X5R1E106M080AC)
C158  value 100 nF  Voltage Rating: 50 V  [FP-C0603C-CF-IPC_B]  (hidden comment: C0603C104M5RACTU)
C159  value 100 nF  Voltage Rating: 50 V  [FP-C0603C-CF-IPC_B]  (hidden comment: C0603C104M5RACTU)
C160  Capacitance: 1 uF  Voltage Rating: 25V  [FP-GCM188-0_1-IPC_B]  (hidden comment: GCM188R71E105KA64D)
C161  value 100 nF  Voltage Rating: 50 V  [FP-C0603C-CF-IPC_B]  (hidden comment: C0603C104M5RACTU)
C162  Capacitance: 100 nF  Voltage Rating: 16V  [FP-CL752-IPC_B]  (hidden comment: CL05B104KO5VPNC)
C163  Voltage Rating: 25V  Capacitance: 10uF  [FP-C1608-080-IPC_B]  (hidden comment: C1608X5R1E106M080AC)
C164  Capacitance: 100 nF  Voltage Rating: 16V  [FP-CL752-IPC_B]  (hidden comment: CL05B104KO5VPNC)
C165  Voltage Rating: 25V  Capacitance: 10uF  [FP-C1608-080-IPC_B]  (hidden comment: C1608X5R1E106M080AC)
C166  Capacitance: 100 nF  Voltage Rating: 16V  [FP-CL752-IPC_B]  (hidden comment: CL05B104KO5VPNC)
C167  Voltage Rating: 25V  Capacitance: 10uF  [FP-C1608-080-IPC_B]  (hidden comment: C1608X5R1E106M080AC)
C168  Capacitance: 100 nF  Voltage Rating: 16V  [FP-CL752-IPC_B]  (hidden comment: CL05B104KO5VPNC)
C169  Voltage Rating: 25V  Capacitance: 10uF  [FP-C1608-080-IPC_B]  (hidden comment: C1608X5R1E106M080AC)
C170  Capacitance: 100 nF  Voltage Rating: 16V  [FP-CL752-IPC_B]  (hidden comment: CL05B104KO5VPNC)
C171  Voltage Rating: 25V  Capacitance: 10uF  [FP-C1608-080-IPC_B]  (hidden comment: C1608X5R1E106M080AC)
C172  Capacitance: 100 nF  Voltage Rating: 16V  [FP-CL752-IPC_B]  (hidden comment: CL05B104KO5VPNC)
C173  Capacitance: 100 nF  Voltage Rating: 16V  [FP-CL752-IPC_B]  (hidden comment: CL05B104KO5VPNC)
C174  Voltage Rating: 25V  Capacitance: 10uF  [FP-C1608-080-IPC_B]  (hidden comment: C1608X5R1E106M080AC)
C175  Voltage Rating: 25V  Capacitance: 10uF  [FP-C1608-080-IPC_B]  (hidden comment: C1608X5R1E106M080AC)
C176  Capacitance: 100 nF  Voltage Rating: 16V  [FP-CL752-IPC_B]  (hidden comment: CL05B104KO5VPNC)
C177  Voltage Rating: 25V  Capacitance: 10uF  [FP-C1608-080-IPC_B]  (hidden comment: C1608X5R1E106M080AC)
C178  Capacitance: 100 nF  Voltage Rating: 16V  [FP-CL752-IPC_B]  (hidden comment: CL05B104KO5VPNC)
R65  Resistance: 0Ω  [FP-CRCW0603-HPe3-IPC_B]  (hidden comment: CRCW06030000Z0EAHP)
R66  Resistance: 0Ω  [FP-CRCW0603-HPe3-IPC_B]  (hidden comment: CRCW06030000Z0EAHP)
R245  Resistance: 10kΩ  [FP-RC0603-0_55-IPC_B]  (hidden comment: RC0603FR-0710KL)
R246  Resistance: 10kΩ  [FP-RC0603-0_55-IPC_B]  (hidden comment: RC0603FR-0710KL)
R248  Resistance: 10kΩ  [FP-RC0603-0_55-IPC_B]  (hidden comment: RC0603FR-0710KL)
R250  Resistance: 10kΩ  [FP-RC0603-0_55-IPC_B]  (hidden comment: RC0603FR-0710KL)
R252  Resistance: 4.7kΩ  [FP-AC0603-IPC_B]  (hidden comment: AC0603FR-074K7L)
R254  Resistance: 10kΩ  [FP-RC0603-0_55-IPC_B]  (hidden comment: RC0603FR-0710KL)
TP90  5019  [KSTN-5019_V]  (value not drawn)
TP91  5019  [KSTN-5019_V]  (value not drawn)
TP92  5019  [KSTN-5019_V]  (value not drawn)
TP93  5019  [KSTN-5019_V]  (value not drawn)
TP94  5019  [KSTN-5019_V]  (value not drawn)
TP95  5019  [KSTN-5019_V]  (value not drawn)
TP96  5019  [KSTN-5019_V]  (value not drawn)
TP97  5019  [KSTN-5019_V]  (value not drawn)
TP98  5019  [KSTN-5019_V]  (value not drawn)
U19  ADS8686SIPZAR  [TI-RECOMMENDED]  (part B of 2)
U20  ADR421ARZ-REEL7  [ADI-R-8_M]  (parts A,B of 2)

### Ports
BUSY (bidir, see 1[2B]), CONVST (bidir, see 1[2B]), NSS (bidir, see 1[2B]), RESET (bidir, see 1[2B]), SCLK (bidir, see 1[2B])

### Nets
+2.5VREF: C159.1 C160.1 R246.1 TP90.1 U20.6(VOUT)
+3.3V: C177.1 C178.1 R245.2 R248.1 R252.2 R254.1 U19.49(VDRIVE)
+5V: C161.1 R65.1 R66.1
AD_+5V: C163.1 C164.1 C165.1 C166.1 C167.1 C168.1 C169.1 C170.1 R66.2 U19.6(VCC) U19.15(VCC) U19.30(VCC) U19.71(VCC)
GND: C154.2 C155.2 C156.2 C157.2 C158.2 C159.2 C160.2 C161.2 C162.2 C163.2 C164.2 C165.2 C166.2 C167.2 C168.2 C169.2 C170.2 C171.2 C172.2 C173.2 C174.2 C175.2 C176.2 C177.2 C178.2 R250.1 U19.5(AGND) U19.16(AGND) U19.29(AGND) U19.32(REFGND) U19.34(REFINOUTGND) U19.37(SEQEN) U19.38(HW_RNGSEL1) U19.39(HW_RNGSEL0) U19.50(DGND) U19.51(REGGNDD) U19.61(~{WR}/BURST) U19.64(CHSEL0) U19.65(CHSEL1) U19.66(CHSEL2) U19.69(REGGND) U19.72(AGND) U20.4(GND)
REFCAP: C174.1 TP98.1 U19.31(REFCAP)
REFINOUT: C173.1 R246.2 U19.33(REFINOUT)
REGCAP: C171.1 C172.1 TP96.1 U19.70(REGCAP)
REGCAPD: C175.1 C176.1 TP97.1 U19.52(REGCAPD)
ADC_BUSY: TP92.1 U19.67(BUSY) ; port BUSY
ADC_CONVST: TP93.1 U19.68(CONVST) ; port CONVST
ADC_RESET: C162.1 R254.2 TP95.1 U19.36(~{RESET}) ; port RESET
PA4: R252.1 TP94.1 U19.63(~{CS}) ; port NSS
PA5: TP91.1 U19.62(SCLK/~{RD}) ; port SCLK
REFSEL: R248.2 R250.2 U19.35(REFSEL)
SER/PAR: R245.1 U19.40(SER/~{PAR})
NetC154_1: C154.1 C155.1 C156.1 C157.1 C158.1 R65.2 U20.2(VIN)

Not connected (* = marked no-connect by the designer): U20 1(TP)* 3(NC)* 5(TRIM)* 7(NC)* 8(TP)*

### Library data of the parts
C154-C157 C163 C165 C167 C169 C171 C174 C175 C177 = CMP-2000-05442-2: as C137 on sheet FLASH; Dielectric: X5R; Length: 1.6mm; Termination: SMD/SMT; Depth: 0.8mm; RoHS Compliant: Yes; Construction: Flat; Weight: 7.1E-05oz; Thickness: 0.039inch; Packaging: Tape and Reel; Min Operating Temperature: -55°C; Case Code (Imperial): 0603; Case/Package: 0603; Height: 0.8mm; Case Code (Metric): 1608; Resistor Type: Ceramic; Voltage Rating (DC): 25V; Max Operating Temperature: 85°C; REACH SVHC: No SVHC; Lead Free: Lead Free; Series: C; Width: 0.8mm; Mount: Surface Mount; Package Quantity: 1
C158 C159 C161 = CMP-2006-03068-2: as C115 on sheet DIGITAL_INPUTS; Temperature Range High: +125°C; Device Class L3: Ceramic Capacitors; Manufacturer Part Number: C0603C104M5RACTU; Height: 0.87mm; Category: Cap; RoHS: TRUE; Digikey Description: CAP CER 0.1UF 50V 20% X7R 0603; ComponentLink2URL: https://api.kemet.com/component-edge/download/datasheet/C0603C100J5GACAUTO.pdf; Lead Free: Yes; Temperature Range Low: -55°C; Device Class L1: Passive Components; ComponentLink2Description: Datasheet; Temperature Characteristic: X7R; Automotive: Yes; Temperature: -55°C to +125°C; Octopart: https://octopart.com/c0603c104m5ractu-kemet-11855687; Device Class L2: Capacitors; Package: C0603C-CF; Mouser Description: Multilayer Ceramic Capacitors MLCC - SMD/SMT 50volts 0.1uF X7R 20%
C160 = CMP-2006-02363-4: Manufacturer Lifecycle Status: IN PRODUCTION; NexarPartId: 18909256; Dielectric: X7R; Material: Ceramic; Tolerance: 10%; Thickness: 889µm; Max Operating Temperature: 125°C; Radiation Hardening: No; Weight: 6.293594mg; Lead Free: Lead Free; Mount: Surface Mount; Case Code (Imperial): 0603; REACH SVHC: No SVHC; Lifecycle Status: Production; Depth: 800µm; Min Operating Temperature: -55°C; Height: 800µm; Case Code (Metric): 1608; Case/Package: 0603; Voltage: 25V; Packaging: Cut Tape; Length: 1.6mm; Termination: SMD/SMT; Width: 787.4µm; Voltage Rating (DC): 25V; RoHS: Compliant; Schedule B: 8532240020, 8532240020; Ratings: AEC-Q200
C162 C164 C166 C168 C170 C172 C173 C176 C178 = CMP-13271-002128-1: Cap Ceramic 100nF 16V X7R ±10% SMD 0402 +125°C Paper T/R; Length: 0.039inch; Case Code (Metric): 1005; Thickness: 0.022inch; Max Operating Temperature: 125°C; Mount: Surface Mount; Features: Soft Termination; Width: 0.02inch; Min Operating Temperature: -55°C; Tolerance: 10%; Case/Package: 0402; Packaging: Cut Tape; Ratings: AEC-Q200; Case Code (Imperial): 0402; Lead Free: Lead Free
R65 R66 = CMP-2000-03817-2: RES Thick Film, 0Ω, , 0.33W, , 0603; Max Power Dissipation: 250mW; Voltage Rating (DC): 75V; Temperature Coefficient: 0ppm/°C; Mount: Surface Mount; Package Quantity: 5000; Features: Automotive AEC-Q200; Length: 1.6mm; Width: 0.033inch; Min Operating Temperature: -55°C; Max Operating Temperature: 155°C; Contact Plating: Tin; Depth: 0.85mm; Case/Package: 0603; Radiation Hardening: No; Military Standard: Not; Power Rating: 250mW; Height: 0.45mm; Composition: Thick Film; Lead Free: Lead Free; Voltage Rating: 75V; Case Code (Imperial): 0603; Weight: 7.1E-05oz; Number of Terminations: 2; Packaging: Tape and Reel; Number of Pins: 2; Case Code (Metric): 1608; Termination: SMD/SMT
R245 R246 R248 R250 R254 = CMP-2100-03664-2: as R199 on sheet ADS8686S_BLOCK_A; Depth: 0.8mm; Termination: SMD/SMT; Resistor Type: Thick Film; Series: RC; Construction: Rectangular; Features: Moisture Resistant; Packaging: Tape and Reel; Min Operating Temperature: -55°C; Number of Terminations: 2; Lead Pitch: 0.3mm; RoHS Compliant: Yes; Case/Package: 0603; Resistance Tolerance: 1%; Military Standard: Not; Weight: 7.1E-05oz; Number of Pins: 2; Tolerance: 1%; Length: 1.6mm; Case Code (Imperial): 0603; Lead Free: Lead Free; Width: 0.8mm; Max Power Dissipation: 100mW; Height: 0.45mm; Max Operating Temperature: 155°C; Case Code (Metric): 1608; Size Code: 0603
R252 = CMP-2000-04847-3: RES 4.7KΩ 1.00% 0.1W 0603; Temperature Coefficient: 100ppm/°C; Max Power Dissipation: 100mW; Voltage Rating: 50V; Tolerance: 1%; Min Operating Temperature: -55°C; Width: 0.031inch; Features: Moisture Resistant; Case/Package: 0603; Number of Terminations: 2; Height: 0.022inch; Case Code (Imperial): 0603; Construction: Rectangular; Length: 0.063inch; Termination: SMD/SMT; Military Standard: Not; Case Code (Metric): 1608; Lead Free: Lead Free; Depth: 0.8mm; Max Operating Temperature: 155°C; Size Code: 0603; RoHS Compliant: Yes; Series: AC; Resistor Type: Thick Film; Ratings: AEC-Q200; Packaging: Tape and Reel; Power Rating: 100mW
TP90-TP98 = CMP-1672-00008-1: as TP73-TP75 on sheet ADS8686S_BLOCK_A; ComponentLink1Description: Manufacturer URL; Package Quantity: 1000; DatasheetVersion: 03/2014; Packaging: Tape and Reel; ComponentLink2URL: http://www.keyelco.com/product-pdf.cfm?p=1357; ComponentLink1URL: http://www.keyelco.com/; Mount: Surface Mount; Contact Plating: Silver; PackageDescription: 1-Pin Surface Mount Device, Body 3.81 x 2.03 mm; Pins: 1; RoHSCompliant: True; Mounting Technology: Surface Mount; ComponentLink2Description: Datasheet; PackageReference: 5019
U19 = ADS8686SIPZAR: as U19 on sheet ADS8686S_BLOCK_A; Supplier: Mouser; Supplier Part Number: 595-ADS8686SIPZAR; Manufacturer Part Number: ADS8686SIPZAR; RoHS: Yes; Category: Analog to Digital Converters (ADCs); Stock: 975; Pricing: 1=20.61, 10=19.01, 50=18.16, 100=16.24, 1000=13.88, 10000=13.88 (USD); RoHS Compliant: Yes; Supplier 1: Mouser; Supplier Part Number 1: 595-ADS8686SIPZAR
U20 = CMP-0784-00215-1: Ultraprecision, Low Noise, XFET(R) Voltage Reference, 2.5 V Output, 4.5 to 18 V Supply, Industrial, 8-pin SOIC (R-8), Reel; Manufacturer: Analog Devices; Vout: 2.5V; Max V Supply (V): 18; Min V Supply (V): 4.5; Ref Out TC (ppm/C): 2; Mounting Technology: Surface Mount; ComponentLink4URL: Product URL:http://www.analog.com/en/special-linear-functions/voltage-references/adr421/products/product.html; ComponentLink2Description: Datasheet; Code_JEDEC: MS-012-AA; ComponentLink3Description: Package Specification; ComponentLink1Description: Manufacturer URL; PackageVersion: 060506-A, 06/2006; ComponentLink4Description: URL Link1; PackageReference: R-8; ComponentLink3URL: http://www.analog.com/static/imported-files/packages/PKG_PDF/SOIC_Narrow%20(R)/R_8.pdf; Operating Temp Range: -40 to 125 degC; Packing: Reel; DatasheetVersion: Rev. I; PartNumber: ADR421ARZ-REEL7; ComponentLink2URL: http://www.analog.com/static/imported-files/data_sheets/ADR420_421_423_425.pdf; ComponentLink1URL: http://www.analog.com/en/index.html; PackageDescription: 8-Pin Standard Small Outline Package, Body 4.9 x 3.9 mm, Pitch 1.27 mm

## Sheet SDMMC.SchDoc
size A4; SheetNumber: 10; SheetTotal: 14
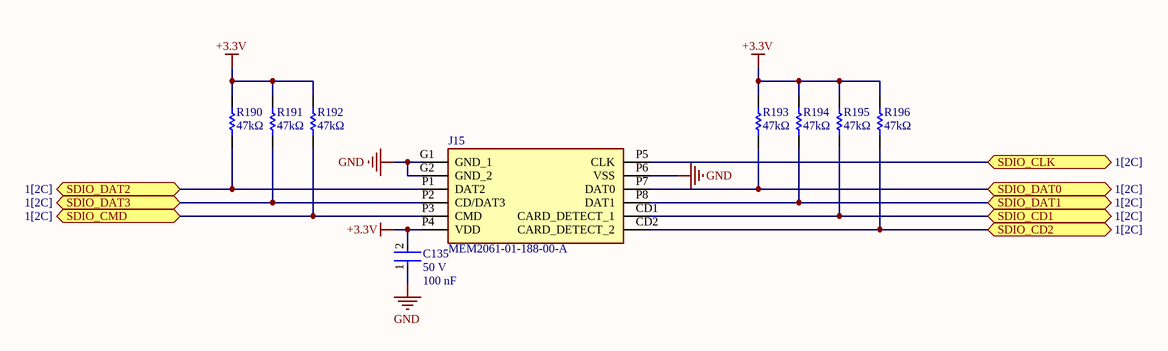
[diagram p12: SDMMC.SchDoc]

### Parts
C135  value 100 nF  Voltage Rating: 50 V  [FP-C0603C-CF-IPC_B]  (hidden comment: C0603C104M5RACTU)
J15  MEM2061-01-188-00-A  [MEM20610118800A]
R190  Resistance: 47kΩ  [RESC1608X55X25ML10T15]  (hidden comment: RC0603FR-1347KL)
R191  Resistance: 47kΩ  [RESC1608X55X25ML10T15]  (hidden comment: RC0603FR-1347KL)
R192  Resistance: 47kΩ  [RESC1608X55X25ML10T15]  (hidden comment: RC0603FR-1347KL)
R193  Resistance: 47kΩ  [RESC1608X55X25ML10T15]  (hidden comment: RC0603FR-1347KL)
R194  Resistance: 47kΩ  [RESC1608X55X25ML10T15]  (hidden comment: RC0603FR-1347KL)
R195  Resistance: 47kΩ  [RESC1608X55X25ML10T15]  (hidden comment: RC0603FR-1347KL)
R196  Resistance: 47kΩ  [RESC1608X55X25ML10T15]  (hidden comment: RC0603FR-1347KL)

### Ports
SDIO_CD1 (bidir, see 1[2C]), SDIO_CD2 (bidir, see 1[2C]), SDIO_CLK (bidir, see 1[2C]), SDIO_CMD (bidir, see 1[2C]), SDIO_DAT0 (bidir, see 1[2C]), SDIO_DAT1 (bidir, see 1[2C]), SDIO_DAT2 (bidir, see 1[2C]), SDIO_DAT3 (bidir, see 1[2C])

### Nets
+3.3V: C135.2 J15.P4(VDD) R190.2 R191.2 R192.2 R193.2 R194.2 R195.2 R196.2
GND: C135.1 J15.G1(GND_1) J15.G2(GND_2) J15.P6(VSS)
PC6: J15.CD2(CARD_DETECT_2) R196.1 ; port SDIO_CD2
PC7: J15.CD1(CARD_DETECT_1) R195.1 ; port SDIO_CD1
PC8: J15.P7(DAT0) R193.1 ; port SDIO_DAT0
PC9: J15.P8(DAT1) R194.1 ; port SDIO_DAT1
PC10: J15.P1(DAT2) R190.1 ; port SDIO_DAT2
PC11: J15.P2(CD/DAT3) R191.1 ; port SDIO_DAT3
PC12: J15.P5(CLK) ; port SDIO_CLK
PD2: J15.P3(CMD) R192.1 ; port SDIO_CMD

### Library data of the parts
C135 = CMP-2006-03068-2: as C115 on sheet DIGITAL_INPUTS; Temperature Range High: +125°C; Device Class L3: Ceramic Capacitors; Manufacturer Part Number: C0603C104M5RACTU; Height: 0.87mm; Category: Cap; RoHS: TRUE; Digikey Description: CAP CER 0.1UF 50V 20% X7R 0603; ComponentLink2URL: https://api.kemet.com/component-edge/download/datasheet/C0603C100J5GACAUTO.pdf; Lead Free: Yes; Temperature Range Low: -55°C; Device Class L1: Passive Components; ComponentLink2Description: Datasheet; Temperature Characteristic: X7R; Automotive: Yes; Temperature: -55°C to +125°C; Octopart: https://octopart.com/c0603c104m5ractu-kemet-11855687; Device Class L2: Capacitors; Package: C0603C-CF; Mouser Description: Multilayer Ceramic Capacitors MLCC - SMD/SMT 50volts 0.1uF X7R 20%
J15 = MEM2061-01-188-00-A: Connector; Manufacturer_Name: GCT (GLOBAL CONNECTOR TECHNOLOGY); Datasheet Link: https://gct.co/files/drawings/mem2061.pdf?v=db251ddb-1946-4f24-aa19-b8a17901bdd2; Height: 2.13mm; Manufacturer_Part_Number: MEM2061-01-188-00-A; Mouser Part Number: 640-MEM20610118800A; Mouser Price/Stock: https://www.mouser.co.uk/ProductDetail/GCT/MEM2061-01-188-00-A?qs=KUoIvG%2F9IlYc25USp0M1eQ%3D%3D
R190-R196 = CMP-2000-04221-1: Manufacturer: Yageo; Part Number: RC0603FR-1347KL